# EAGLE design v.0.0.4 (EAGLE 5.11)

## Sheet 1 of 8
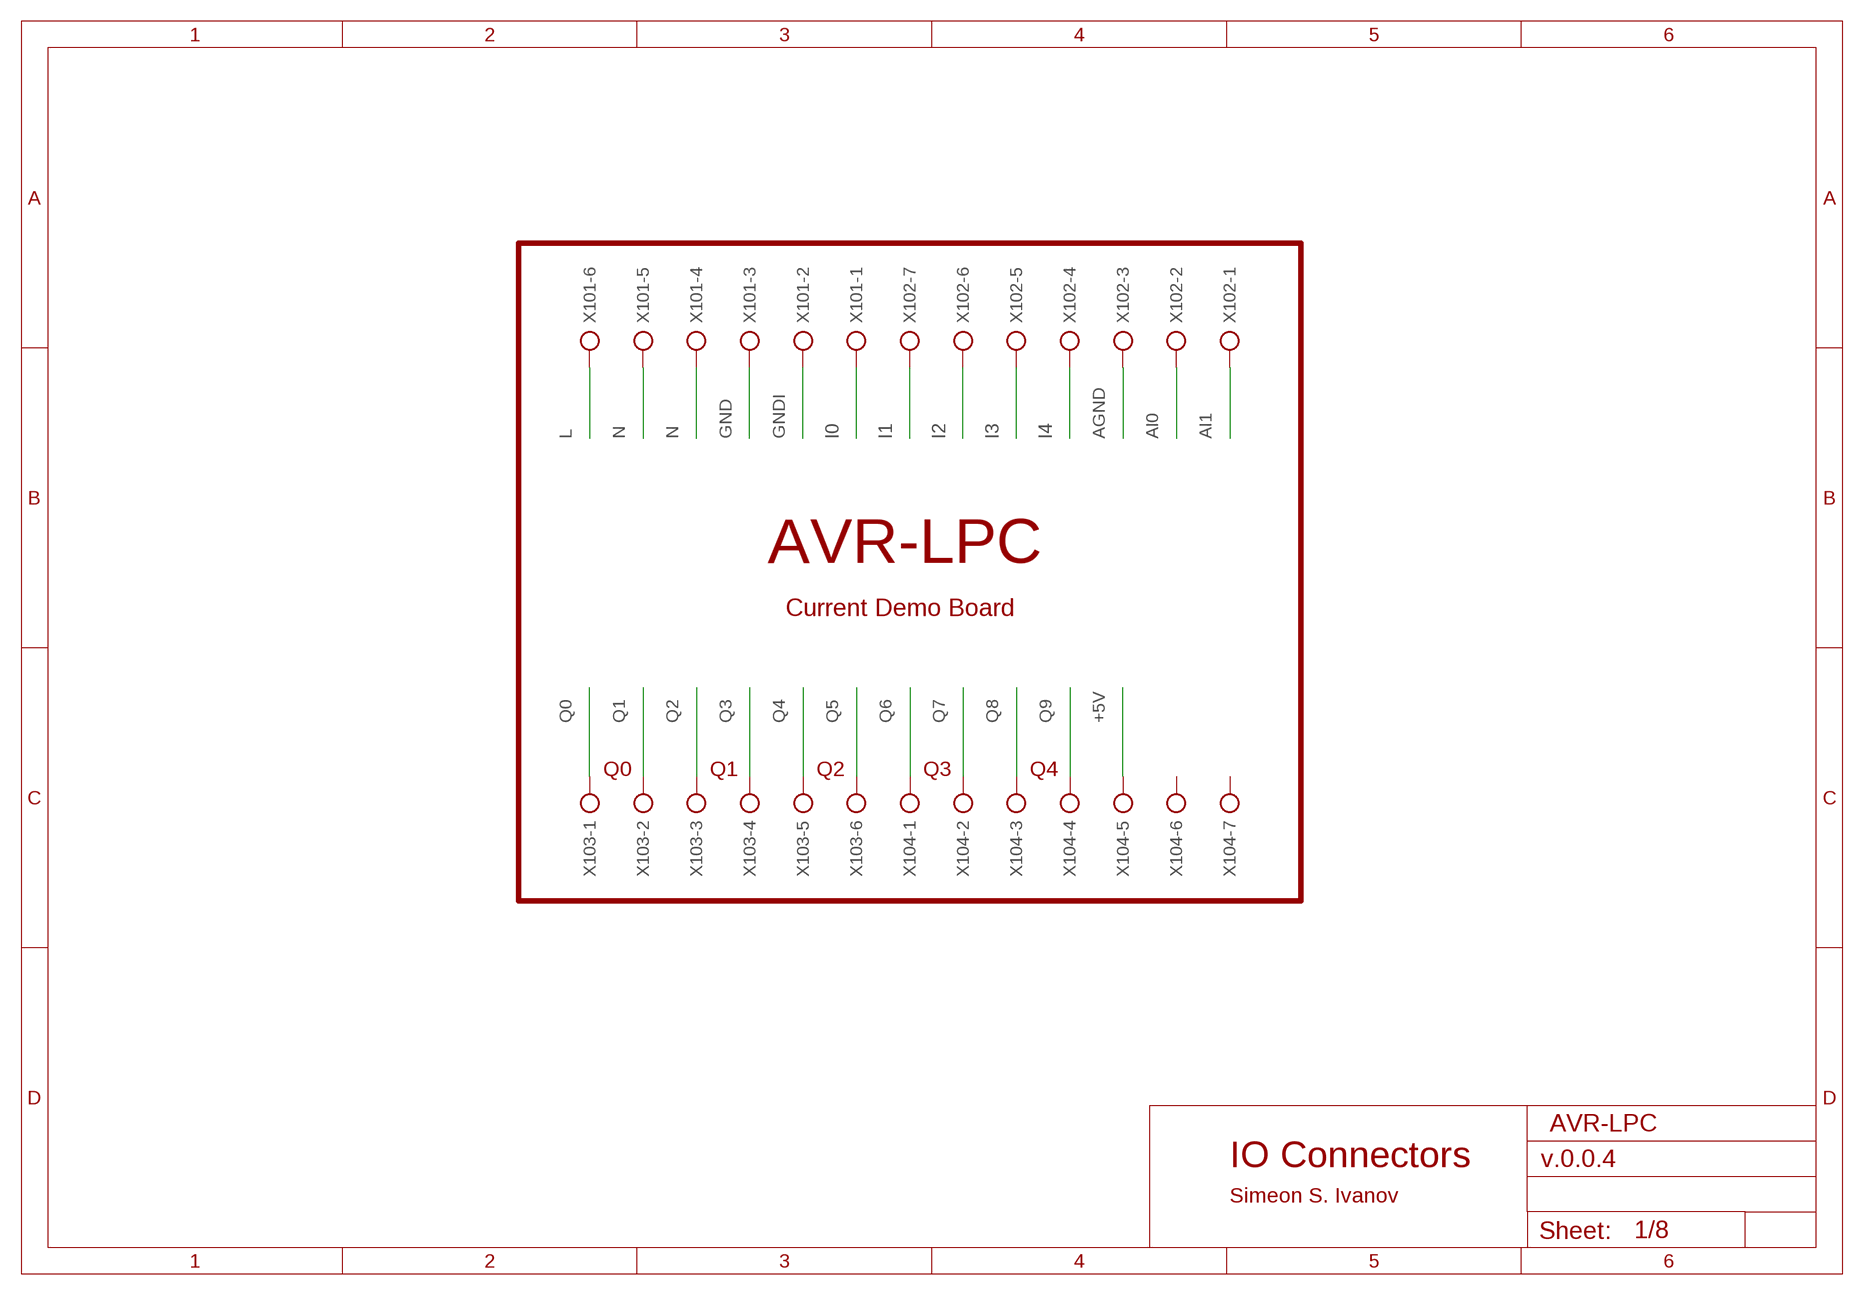
[diagram p0: schematic, sheet 1]

### Parts
X101  AK500/61  [AWG/6-H]
X102  AK500/71  [AWG/7-H]
X103  AK500/61  [AWG/6-H]
X104  AK500/71  [AWG/7-H]

### Nets
+5V: X104.5 ; also sheet 2,3,4,5,6
AGND: X102.3 ; also sheet 2,8
AI0: X102.2 ; also sheet 8
AI1: X102.1 ; also sheet 8
GND: X101.3 ; also sheet 2,3,4,5,6,7
GNDI: X101.2 ; also sheet 2,6
I0: X101.1 ; also sheet 6
I1: X102.7 ; also sheet 6
I2: X102.6 ; also sheet 6
I3: X102.5 ; also sheet 6
I4: X102.4 ; also sheet 6
L: X101.6 ; also sheet 2
N: X101.4 X101.5 ; also sheet 2
Q0: X103.1 ; also sheet 7
Q1: X103.2 ; also sheet 7
Q2: X103.3 ; also sheet 7
Q3: X103.4 ; also sheet 7
Q4: X103.5 ; also sheet 7
Q5: X103.6 ; also sheet 7
Q6: X104.1 ; also sheet 7
Q7: X104.2 ; also sheet 7
Q8: X104.3 ; also sheet 7
Q9: X104.4 ; also sheet 7
Unconnected: X104.6 X104.7

### Notes on the sheet
- AVR-LPC
- Current Demo Board
- Q0 | Q1 | Q2 | Q3 | Q4
- AVR-LPC
- IO Connectors
- Simeon S. Ivanov

## Sheet 2 of 8
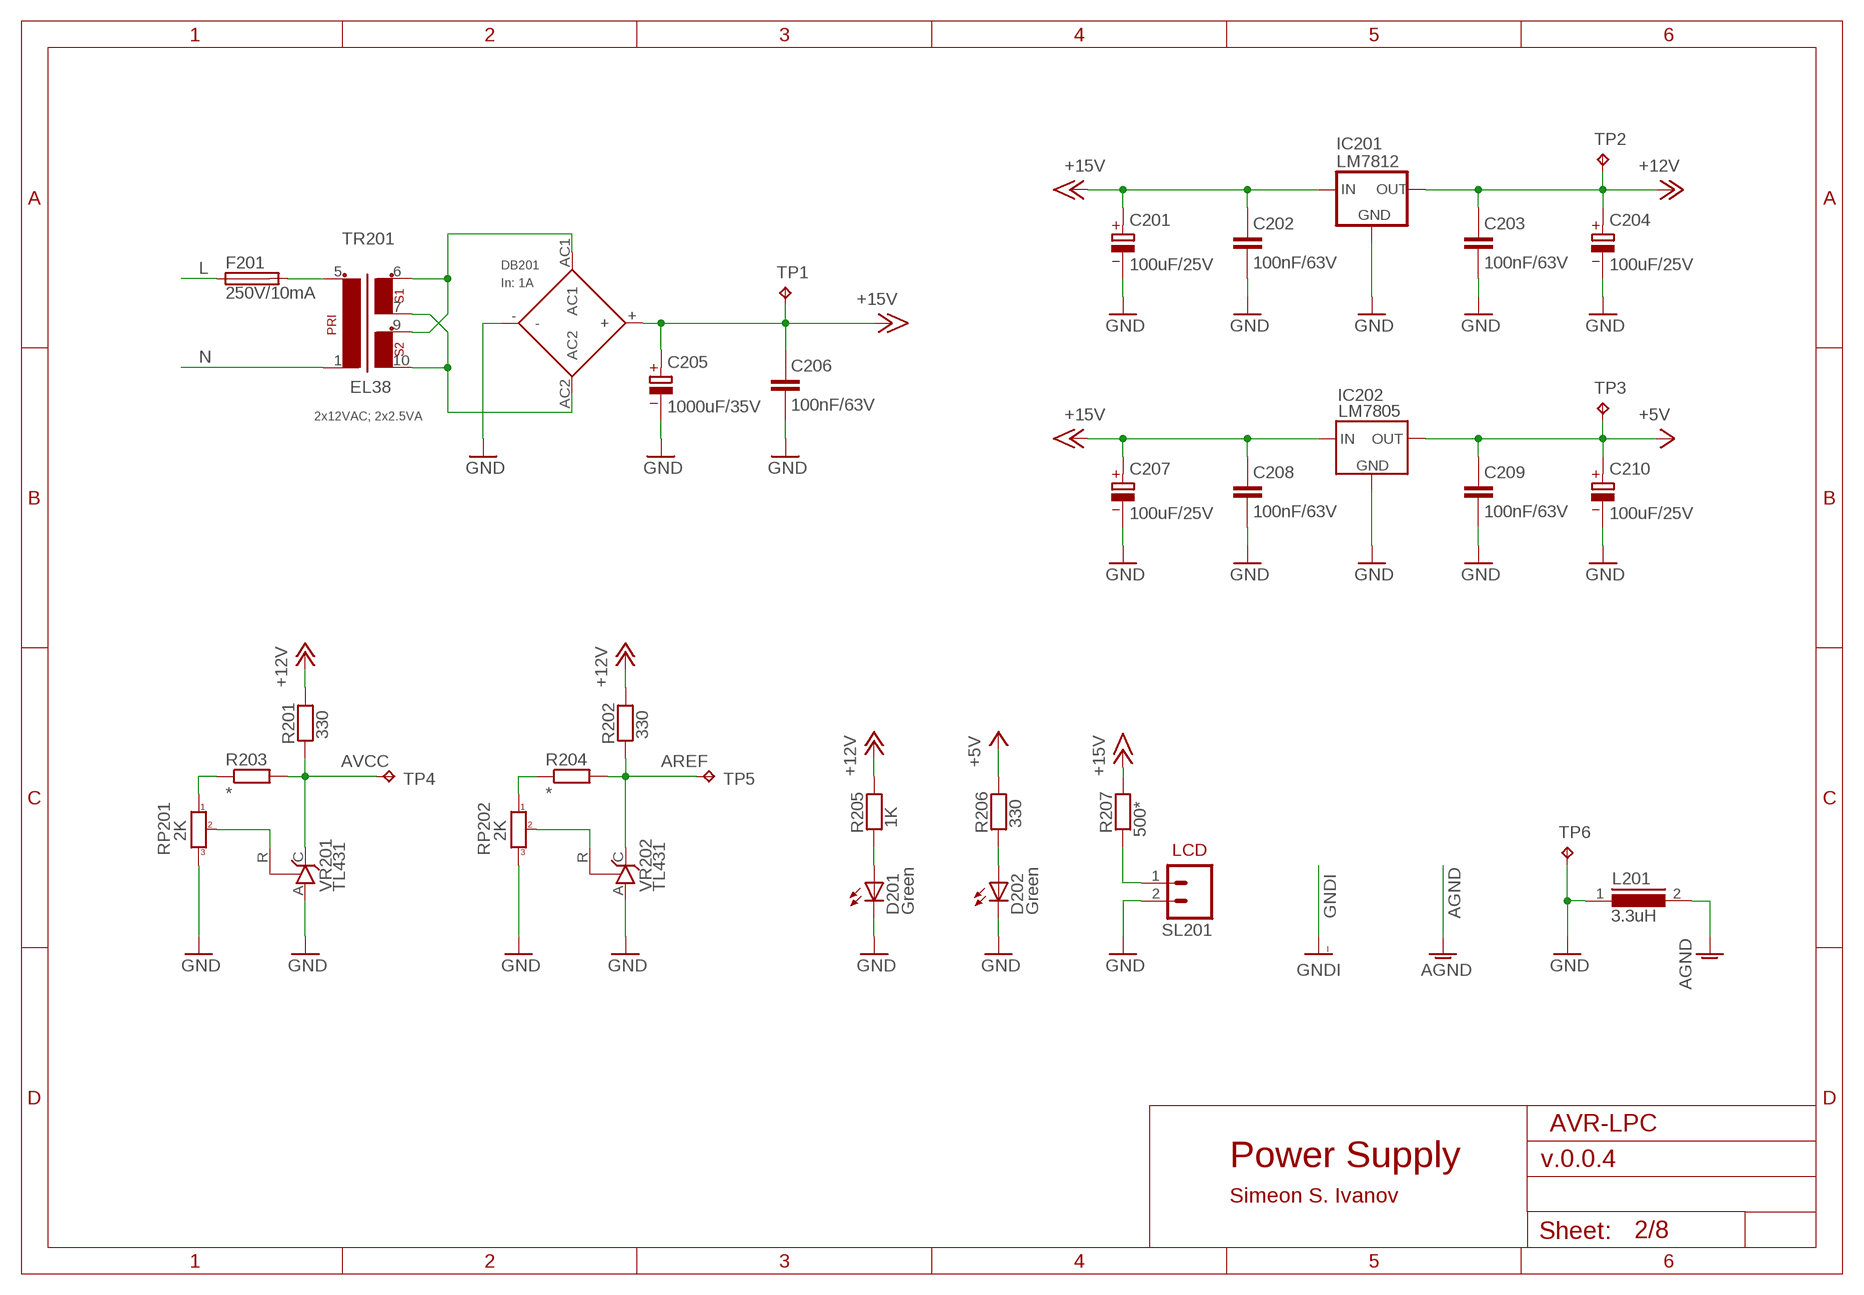
[diagram p1: schematic, sheet 2]

### Parts
C201  100uF/25V  CPOL-EU_Ø250  [CP100X80X24]
C202  100nF/63V  C-EU_2  [C100X86X24]
C203  100nF/63V  C-EU_2  [C100X86X24]
C204  100uF/25V  CPOL-EU_Ø250  [CP100X80X24]
C205  1000uF/35V  CPOL-EU_Ø500Ø400Ø300  [CP500/300X100X24]
C206  100nF/63V  C-EU_3  [C200X100X24]
C207  100uF/25V  CPOL-EU_Ø250  [CP100X80X24]
C208  100nF/63V  C-EU_3  [C200X100X24]
C209  100nF/63V  C-EU_3  [C200X100X24]
C210  100uF/25V  CPOL-EU_Ø250  [CP100X80X24]
D201  Green  LED5MM  [LED5MM]
D202  Green  LED5MM  [LED5MM]
DB201  In: 1A  DB104  [DB104]
F201  250V/10mA  GSH15  [GSH15]
IC201  LM7812  78LXX  [78LXX]
IC202  LM7805  78XXSC1  [78XX_VERTICAL_COOLER]
L201  3.3uH  MICC12  [MICC12]
R201  330  R-EU_2  [R100X86X24]
R202  330  R-EU_2  [R100X86X24]
R203  *  R-EU_M0805  [M0805]
R204  *  R-EU_M0805  [M0805]
R205  1K  R-EU_3  [R200X86X24]
R206  330  R-EU_3  [R200X86X24]
R207  500*  R-EU_11  [R425X86X24]
RP201  2K  RP-EU_  [RP0]
RP202  2K  RP-EU_  [RP0]
SL201  M02  [02P]
TP1  TPPAD1-17  [P1-17]
TP2  TPPAD1-17  [P1-17]
TP3  TPPAD1-17  [P1-17]
TP4  TPPAD1-17  [P1-17]
TP5  TPPAD1-17  [P1-17]
TP6  TPPAD1-17  [P1-17]
TR201  EL38  EI38-2  [EI38-2]
VR201  TL431  TL431CLP  [TO92-CLP]
VR202  TL431  TL431CLP  [TO92-CLP]

### Nets
+5V: C209.P$1 C210.+ IC202.OUT R206.P$2 TP3.TP ; also sheet 1,3,4,5,6
+12V: C203.P$1 C204.+ IC201.OUT R201.P$2 R202.P$2 R205.P$2 TP2.TP ; also sheet 8
+15V: C201.+ C202.P$1 C205.+ C206.P$1 C207.+ C208.P$1 DB201.+ IC201.IN IC202.IN R207.P$2 TP1.TP ; also sheet 7
AGND: L201.2 ; also sheet 1,8
AREF: R202.P$1 R204.2 TP5.TP VR202.C ; also sheet 3
AVCC: R201.P$1 R203.2 TP4.TP VR201.C ; also sheet 3
GND: C201.- C202.P$2 C203.P$2 C204.- C205.- C206.P$2 C207.- C208.P$2 C209.P$2 C210.- D201.K(C) D202.K(C) DB201.- IC201.GND IC202.GND L201.1 RP201.3 RP202.3 SL201.2 TP6.TP VR201.A VR202.A ; also sheet 1,3,4,5,6,7
L: F201.1 ; also sheet 1
N: TR201.1 ; also sheet 1
N$1: F201.2 TR201.5
N$3: RP201.2 VR201.R
N$5: RP202.2 VR202.R
N$6: DB201.AC1 TR201.6 TR201.9
N$15: R203.1 RP201.1
N$20: D201.A R205.P$1
N$29: R207.P$1 SL201.1
N$34: D202.A R206.P$1
N$37: DB201.AC2 TR201.7 TR201.10
N$47: R204.1 RP202.1

### Notes on the sheet
- 2x12VAC; 2x2.5VA
- LCD
- AVR-LPC
- Power Supply
- Simeon S. Ivanov

## Sheet 3 of 8
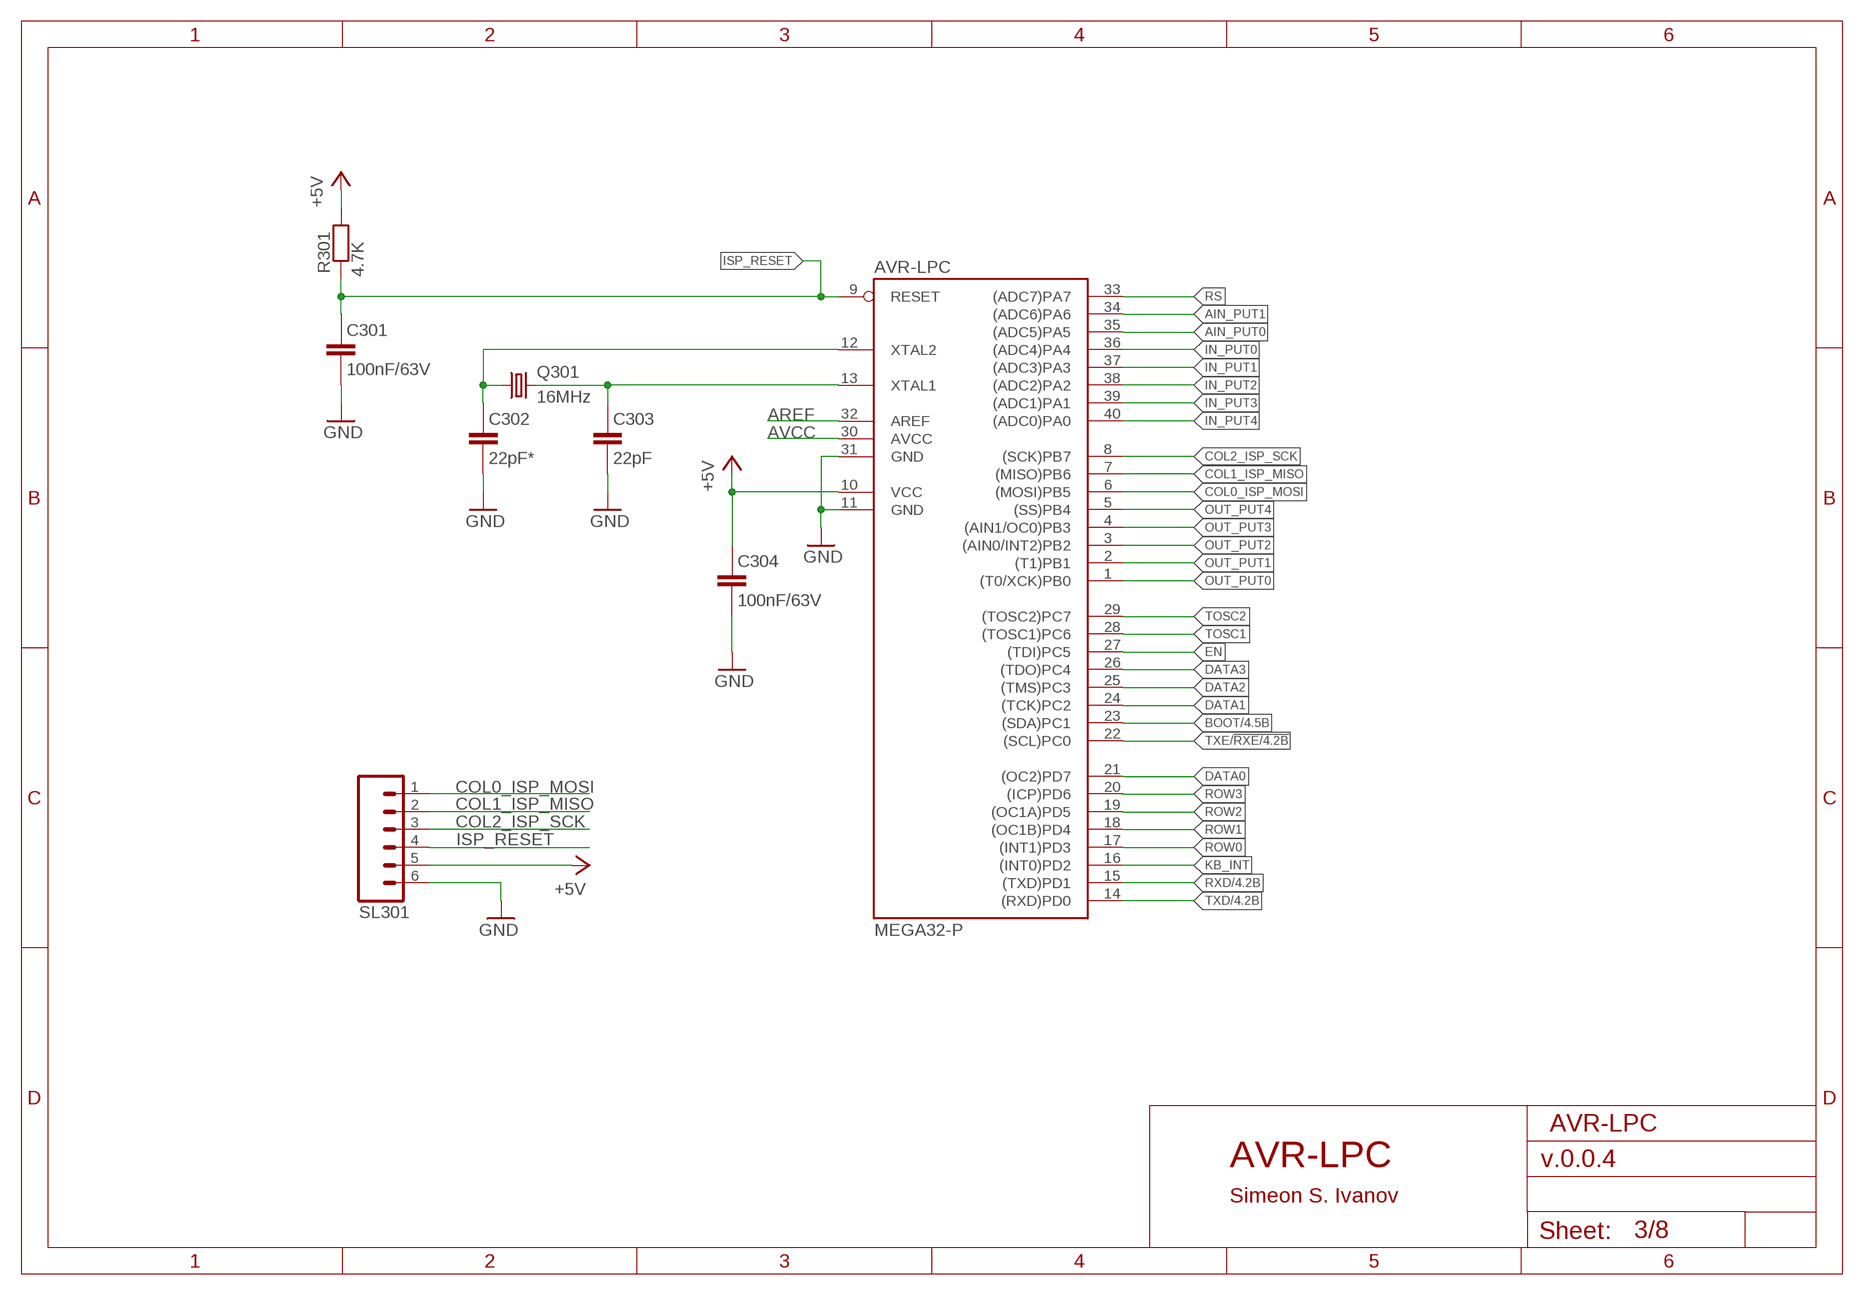
[diagram p2: schematic, sheet 3]

### Parts
AVR-LPC  MEGA32-P  [DIL40]
C301  100nF/63V  C-EU_3  [C200X100X24]
C302  22pF*  C-EU_2  [C100X86X24]
C303  22pF  C-EU_2  [C100X86X24]
C304  100nF/63V  C-EU_3  [C200X100X24]
Q301  16MHz  CRYSTALHC49U-V  [HC49U-V]
R301  4.7K  R-EU_2  [R100X86X24]
SL301  M06  [06P]

### Nets
+5V: AVR-LPC.10(VCC) C304.P$1 R301.P$2 SL301.5 ; also sheet 1,2,4,5,6
AIN_PUT0: AVR-LPC.35((ADC5)PA5) ; also sheet 8
AIN_PUT1: AVR-LPC.34((ADC6)PA6) ; also sheet 8
AREF: AVR-LPC.32(AREF) ; also sheet 2
AVCC: AVR-LPC.30(AVCC) ; also sheet 2
BOOT: AVR-LPC.23((SDA)PC1) ; also sheet 4
COL0_ISP_MOSI: AVR-LPC.6((MOSI)PB5) SL301.1 ; also sheet 5
COL1_ISP_MISO: AVR-LPC.7((MISO)PB6) SL301.2 ; also sheet 5
COL2_ISP_SCK: AVR-LPC.8((SCK)PB7) SL301.3 ; also sheet 5
DATA0: AVR-LPC.21((OC2)PD7) ; also sheet 5
DATA1: AVR-LPC.24((TCK)PC2) ; also sheet 5
DATA2: AVR-LPC.25((TMS)PC3) ; also sheet 5
DATA3: AVR-LPC.26((TDO)PC4) ; also sheet 5
EN: AVR-LPC.27((TDI)PC5) ; also sheet 5
GND: AVR-LPC.11(GND) AVR-LPC.31(GND) C301.P$2 C302.P$2 C303.P$2 C304.P$2 SL301.6 ; also sheet 1,2,4,5,6,7
IN_PUT0: AVR-LPC.36((ADC4)PA4) ; also sheet 6
IN_PUT1: AVR-LPC.37((ADC3)PA3) ; also sheet 6
IN_PUT2: AVR-LPC.38((ADC2)PA2) ; also sheet 6
IN_PUT3: AVR-LPC.39((ADC1)PA1) ; also sheet 6
IN_PUT4: AVR-LPC.40((ADC0)PA0) ; also sheet 6
ISP_RESET: AVR-LPC.9(RESET) C301.P$1 R301.P$1 SL301.4
KB_INT: AVR-LPC.16((INT0)PD2) ; also sheet 5
N$10: AVR-LPC.12(XTAL2) C302.P$1 Q301.1
N$11: AVR-LPC.13(XTAL1) C303.P$1 Q301.2
OUT_PUT0: AVR-LPC.1((T0/XCK)PB0) ; also sheet 7
OUT_PUT1: AVR-LPC.2((T1)PB1) ; also sheet 7
OUT_PUT2: AVR-LPC.3((AIN0/INT2)PB2) ; also sheet 7
OUT_PUT3: AVR-LPC.4((AIN1/OC0)PB3) ; also sheet 7
OUT_PUT4: AVR-LPC.5((SS)PB4) ; also sheet 7
ROW0: AVR-LPC.17((INT1)PD3) ; also sheet 5
ROW1: AVR-LPC.18((OC1B)PD4) ; also sheet 5
ROW2: AVR-LPC.19((OC1A)PD5) ; also sheet 5
ROW3: AVR-LPC.20((ICP)PD6) ; also sheet 5
RS: AVR-LPC.33((ADC7)PA7) ; also sheet 5
RXD: AVR-LPC.15((TXD)PD1) ; also sheet 4
TOSC1: AVR-LPC.28((TOSC1)PC6)
TOSC2: AVR-LPC.29((TOSC2)PC7)
TXD: AVR-LPC.14((RXD)PD0) ; also sheet 4
TXE/!RXE: AVR-LPC.22((SCL)PC0) ; also sheet 4

### Notes on the sheet
- AVR-LPC
- AVR-LPC
- Simeon S. Ivanov

## Sheet 4 of 8
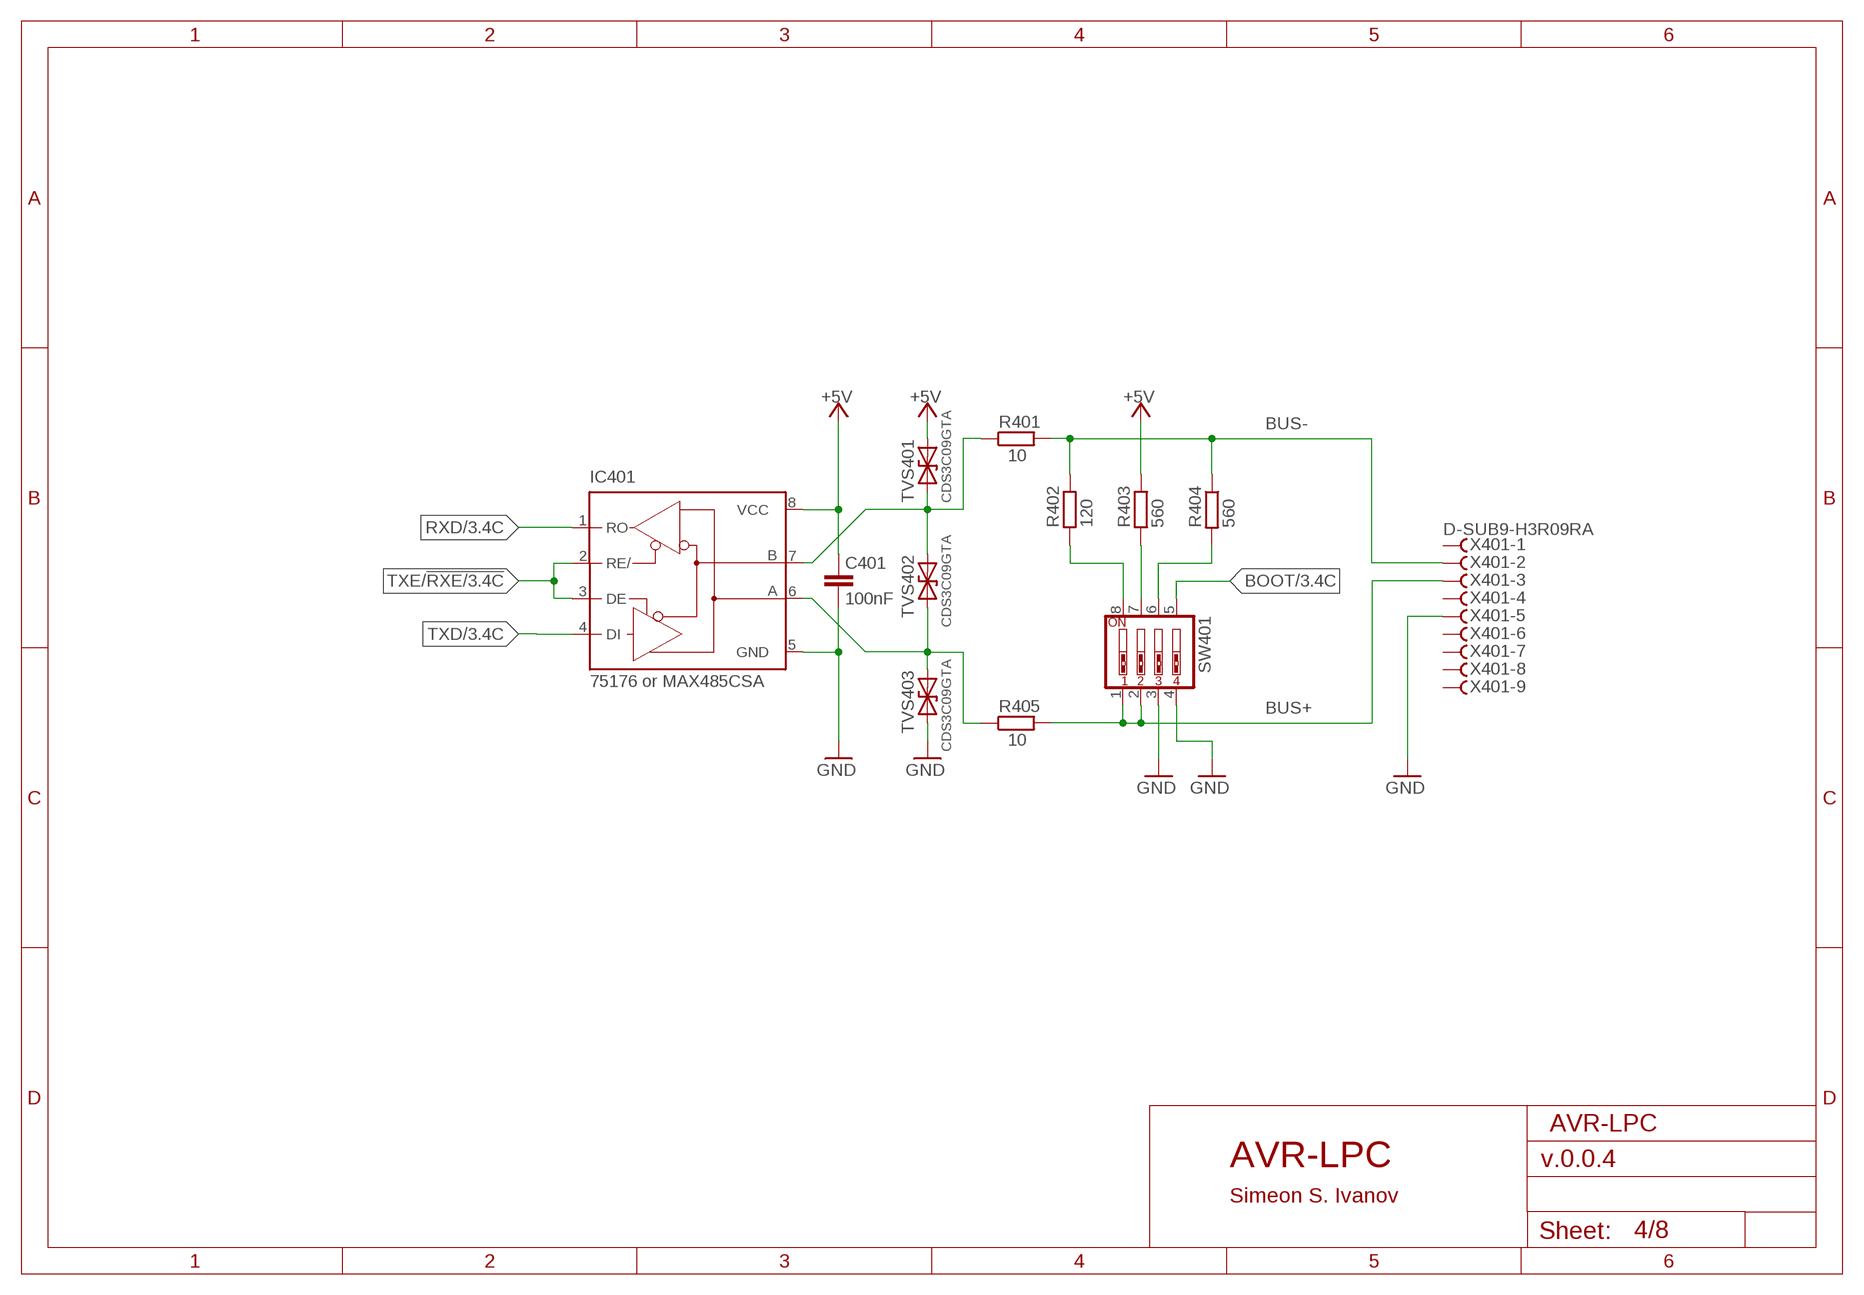
[diagram p3: schematic, sheet 4]

### Parts
C401  100nF  C-EU050-025X075  [C050-025X075]
IC401  75176 or MAX485CSA  MAX3468CSA  [SO08]
R401  10  R-EU_R1206  [R1206]
R402  120  R-EU_R1206  [R1206]
R403  560  R-EU_R0805  [R0805]
R404  560  R-EU_R0805  [R0805]
R405  10  R-EU_R1206  [R1206]
SW401  SW_DIP-4  [EDG-04]
TVS401  CDS3C09GTA  B72500DD06063  [D0603]
TVS402  CDS3C09GTA  B72500DD06063  [D0603]
TVS403  CDS3C09GTA  B72500DD06063  [D0603]
X401  D-SUB9-H3R09RA  [H3R09RA]

### Nets
+5V: C401.2 IC401.8(VCC) R403.2 TVS401.2 ; also sheet 1,2,3,5,6
BOOT: SW401.5 ; also sheet 3
BUS+: R405.2 SW401.1 SW401.2 X401.3
BUS-: R401.2 R402.2 R404.1 X401.2
GND: C401.1 IC401.5(GND) SW401.3 SW401.4 TVS403.1 X401.5 ; also sheet 1,2,3,5,6,7
N$46: IC401.7(B) R401.1 TVS401.1 TVS402.2
N$93: IC401.6(A) R405.1 TVS402.1 TVS403.2
N$112: R403.1 SW401.7
N$129: R404.2 SW401.6
N$140: R402.1 SW401.8
RXD: IC401.1(RO) ; also sheet 3
TXD: IC401.4(DI) ; also sheet 3
TXE/!RXE: IC401.2(RE/) IC401.3(DE) ; also sheet 3
Unconnected: X401.1 X401.4 X401.6 X401.7 X401.8 X401.9

### Notes on the sheet
- AVR-LPC
- AVR-LPC
- Simeon S. Ivanov

## Sheet 5 of 8
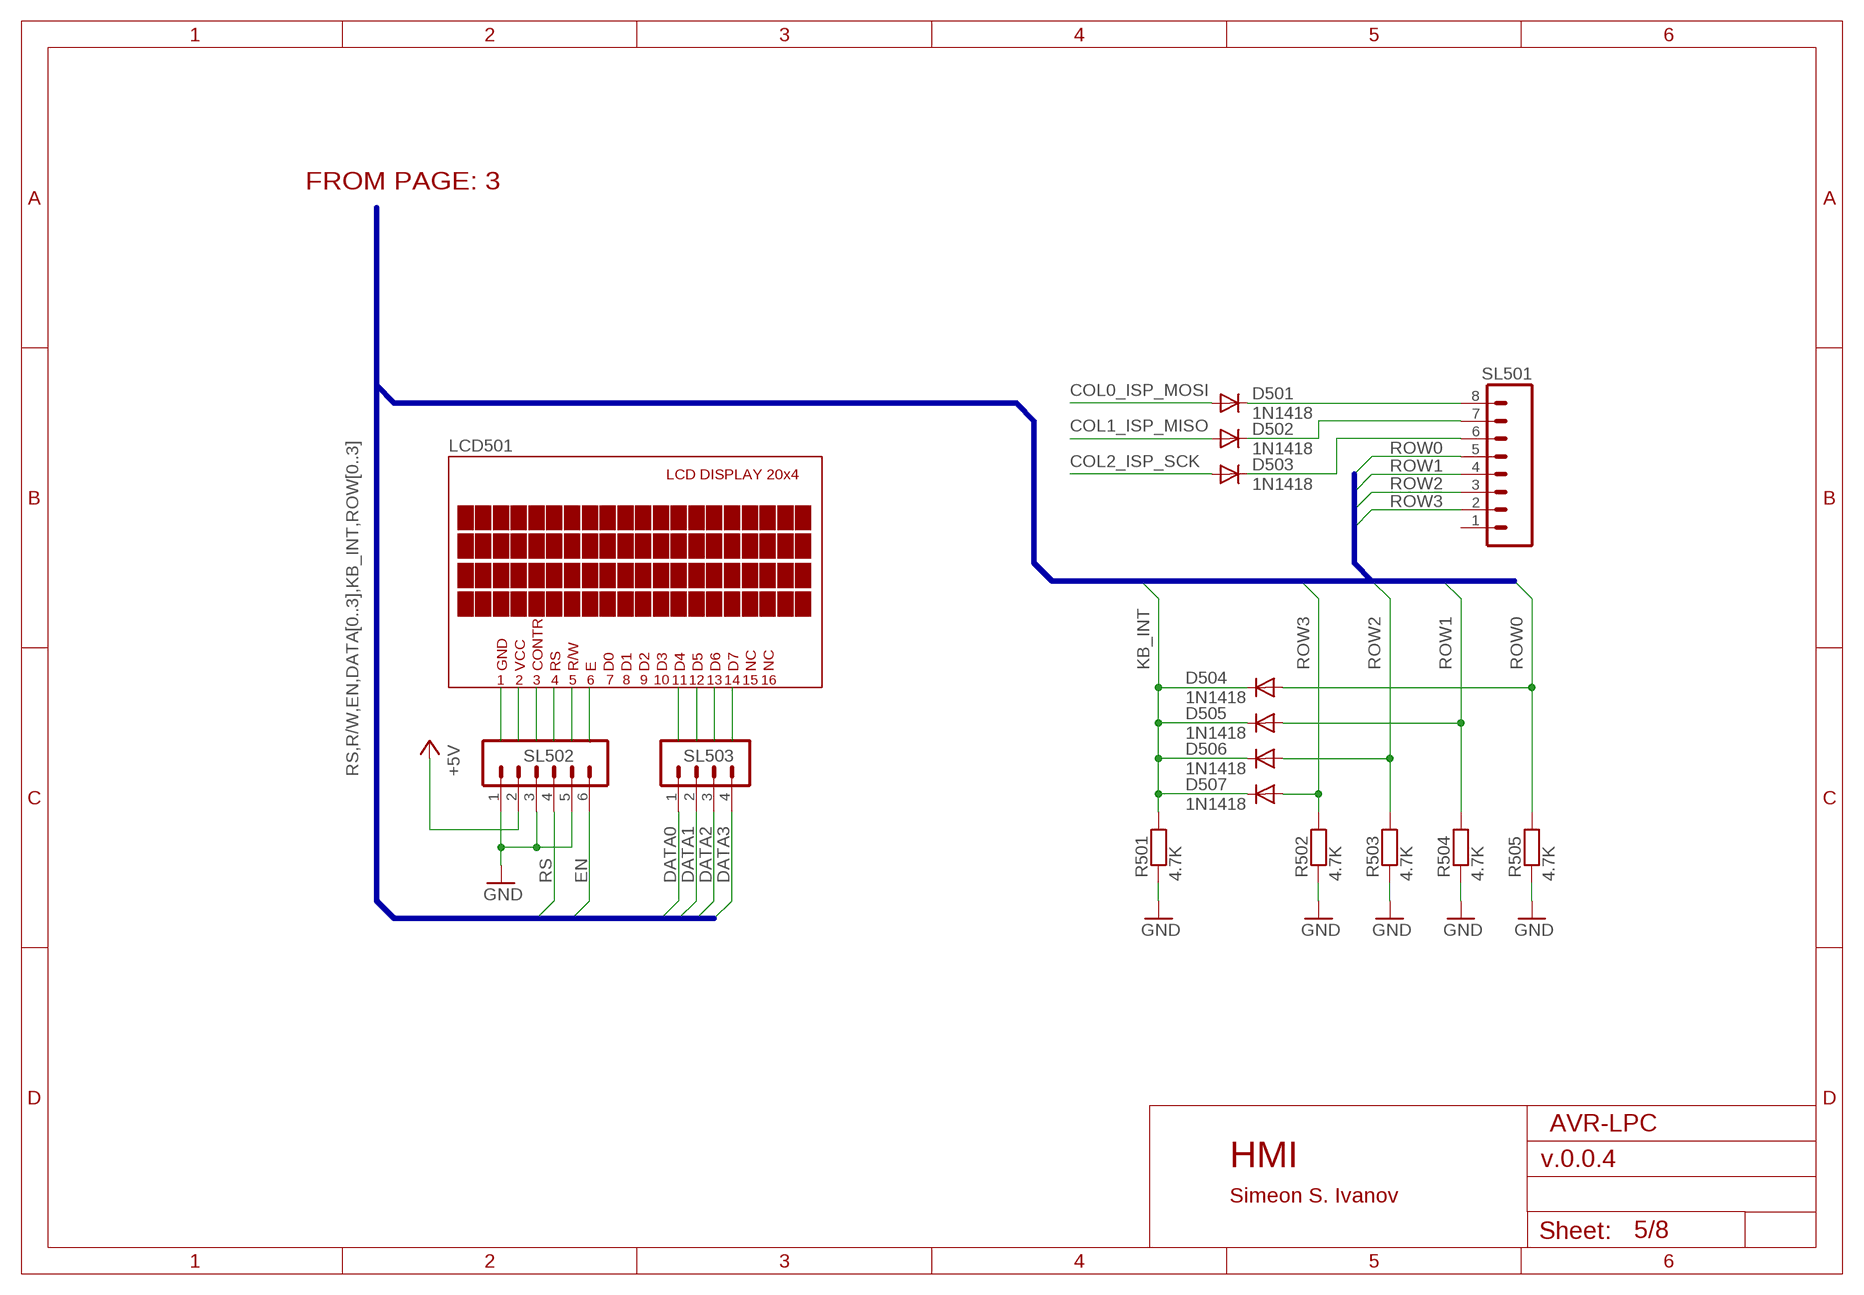
[diagram p4: schematic, sheet 5]

### Parts
D501  1N1418  DIODE-D-5  [D-5]
D502  1N1418  DIODE-D-5  [D-5]
D503  1N1418  DIODE-D-5  [D-5]
D504  1N1418  DIODE-D-2.5  [D-2.5]
D505  1N1418  DIODE-D-2.5  [D-2.5]
D506  1N1418  DIODE-D-2.5  [D-2.5]
D507  1N1418  DIODE-D-2.5  [D-2.5]
LCD501  JM204_SIZESIZE  [JM20X4]
R501  4.7K  R-EU_9  [R300X86X24]
R502  4.7K  R-EU_10  [R350X86X24]
R503  4.7K  R-EU_10  [R350X86X24]
R504  4.7K  R-EU_10  [R350X86X24]
R505  4.7K  R-EU_10  [R350X86X24]
SL501  M08  [08P]
SL502  M06  [06P]
SL503  M04  [04P]

### Nets
+5V: SL502.2 ; also sheet 1,2,3,4,6
COL0_ISP_MOSI: D501.A ; also sheet 3
COL1_ISP_MISO: D502.A ; also sheet 3
COL2_ISP_SCK: D503.A ; also sheet 3
DATA0: SL503.1 ; also sheet 3
DATA1: SL503.2 ; also sheet 3
DATA2: SL503.3 ; also sheet 3
DATA3: SL503.4 ; also sheet 3
EN: SL502.6 ; also sheet 3
GND: R501.P$1 R502.P$1 R503.P$1 R504.P$1 R505.P$1 SL502.1 SL502.3 SL502.5 ; also sheet 1,2,3,4,6,7
KB_INT: D504.C D505.C D506.C D507.C R501.P$2 ; also sheet 3
N$24: D501.C SL501.8
N$25: D502.C SL501.7
N$28: D503.C SL501.6
ROW0: D504.A R505.P$2 SL501.5 ; also sheet 3
ROW1: D505.A R504.P$2 SL501.4 ; also sheet 3
ROW2: D506.A R503.P$2 SL501.3 ; also sheet 3
ROW3: D507.A R502.P$2 SL501.2 ; also sheet 3
RS: SL502.4 ; also sheet 3
Unconnected: SL501.1

### Buses
RS,R/W,EN,DATA[0..3],KB_INT,ROW[0..3]
KB_INT,ROW[0..3]

### Notes on the sheet
- FROM PAGE: 3
- AVR-LPC
- HMI
- Simeon S. Ivanov

## Sheet 6 of 8
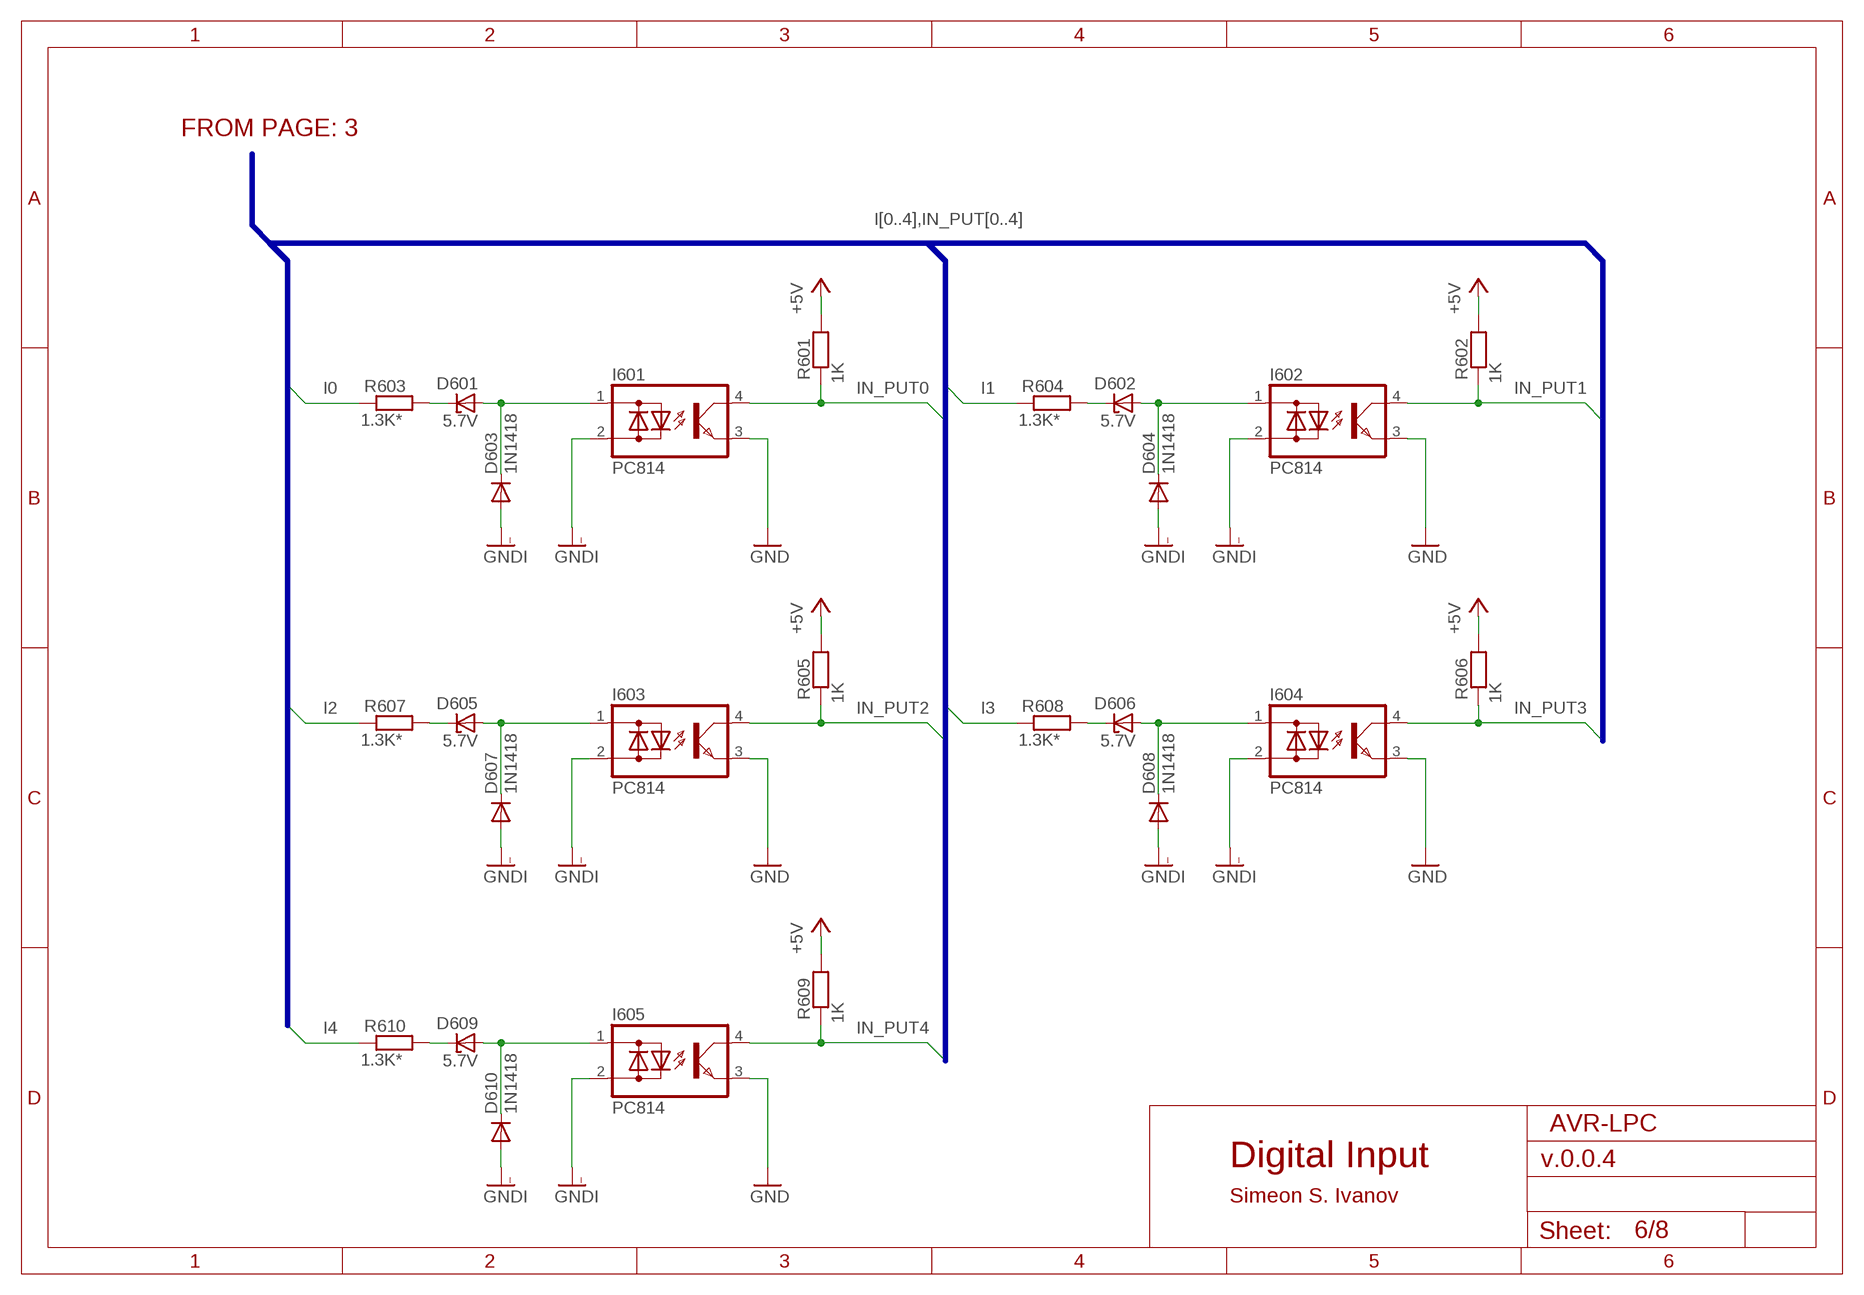
[diagram p5: schematic, sheet 6]

### Parts
D601  5.7V  ZENER-DIODEZD-2.5  [ZDIO-2.5]
D602  5.7V  ZENER-DIODEZD-2.5  [ZDIO-2.5]
D603  1N1418  DIODE-D-2.5  [D-2.5]
D604  1N1418  DIODE-D-2.5  [D-2.5]
D605  5.7V  ZENER-DIODEZD-2.5  [ZDIO-2.5]
D606  5.7V  ZENER-DIODEZD-2.5  [ZDIO-2.5]
D607  1N1418  DIODE-D-2.5  [D-2.5]
D608  1N1418  DIODE-D-2.5  [D-2.5]
D609  5.7V  ZENER-DIODEZD-2.5  [ZDIO-2.5]
D610  1N1418  DIODE-D-2.5  [D-2.5]
I601  PC814  [DIL04]
I602  PC814  [DIL04]
I603  PC814  [DIL04]
I604  PC814  [DIL04]
I605  PC814  [DIL04]
R601  1K  R-EU_11  [R425X86X24]
R602  1K  R-EU_11  [R425X86X24]
R603  1.3K*  R-EU_2  [R100X86X24]
R604  1.3K*  R-EU_2  [R100X86X24]
R605  1K  R-EU_11  [R425X86X24]
R606  1K  R-EU_11  [R425X86X24]
R607  1.3K*  R-EU_2  [R100X86X24]
R608  1.3K*  R-EU_2  [R100X86X24]
R609  1K  R-EU_11  [R425X86X24]
R610  1.3K*  R-EU_2  [R100X86X24]

### Nets
+5V: R601.P$2 R602.P$2 R605.P$2 R606.P$2 R609.P$2 ; also sheet 1,2,3,4,5
GND: I601.3(E) I602.3(E) I603.3(E) I604.3(E) I605.3(E) ; also sheet 1,2,3,4,5,7
GNDI: D603.A D604.A D607.A D608.A D610.A I601.2(AC2) I602.2(AC2) I603.2(AC2) I604.2(AC2) I605.2(AC2) ; also sheet 1,2
I0: R603.P$1 ; also sheet 1
I1: R604.P$1 ; also sheet 1
I2: R607.P$1 ; also sheet 1
I3: R608.P$1 ; also sheet 1
I4: R610.P$1 ; also sheet 1
IN_PUT0: I601.4(C) R601.P$1 ; also sheet 3
IN_PUT1: I602.4(C) R602.P$1 ; also sheet 3
IN_PUT2: I603.4(C) R605.P$1 ; also sheet 3
IN_PUT3: I604.4(C) R606.P$1 ; also sheet 3
IN_PUT4: I605.4(C) R609.P$1 ; also sheet 3
N$22: D601.C R603.P$2
N$23: D601.A D603.C I601.1(AC1)
N$26: D605.C R607.P$2
N$27: D605.A D607.C I603.1(AC1)
N$39: D609.C R610.P$2
N$40: D609.A D610.C I605.1(AC1)
N$43: D602.C R604.P$2
N$44: D602.A D604.C I602.1(AC1)
N$51: D606.C R608.P$2
N$52: D606.A D608.C I604.1(AC1)

### Buses
I[0..4],IN_PUT[0..4]

### Notes on the sheet
- FROM PAGE: 3
- AVR-LPC
- Digital Input
- Simeon S. Ivanov

## Sheet 7 of 8
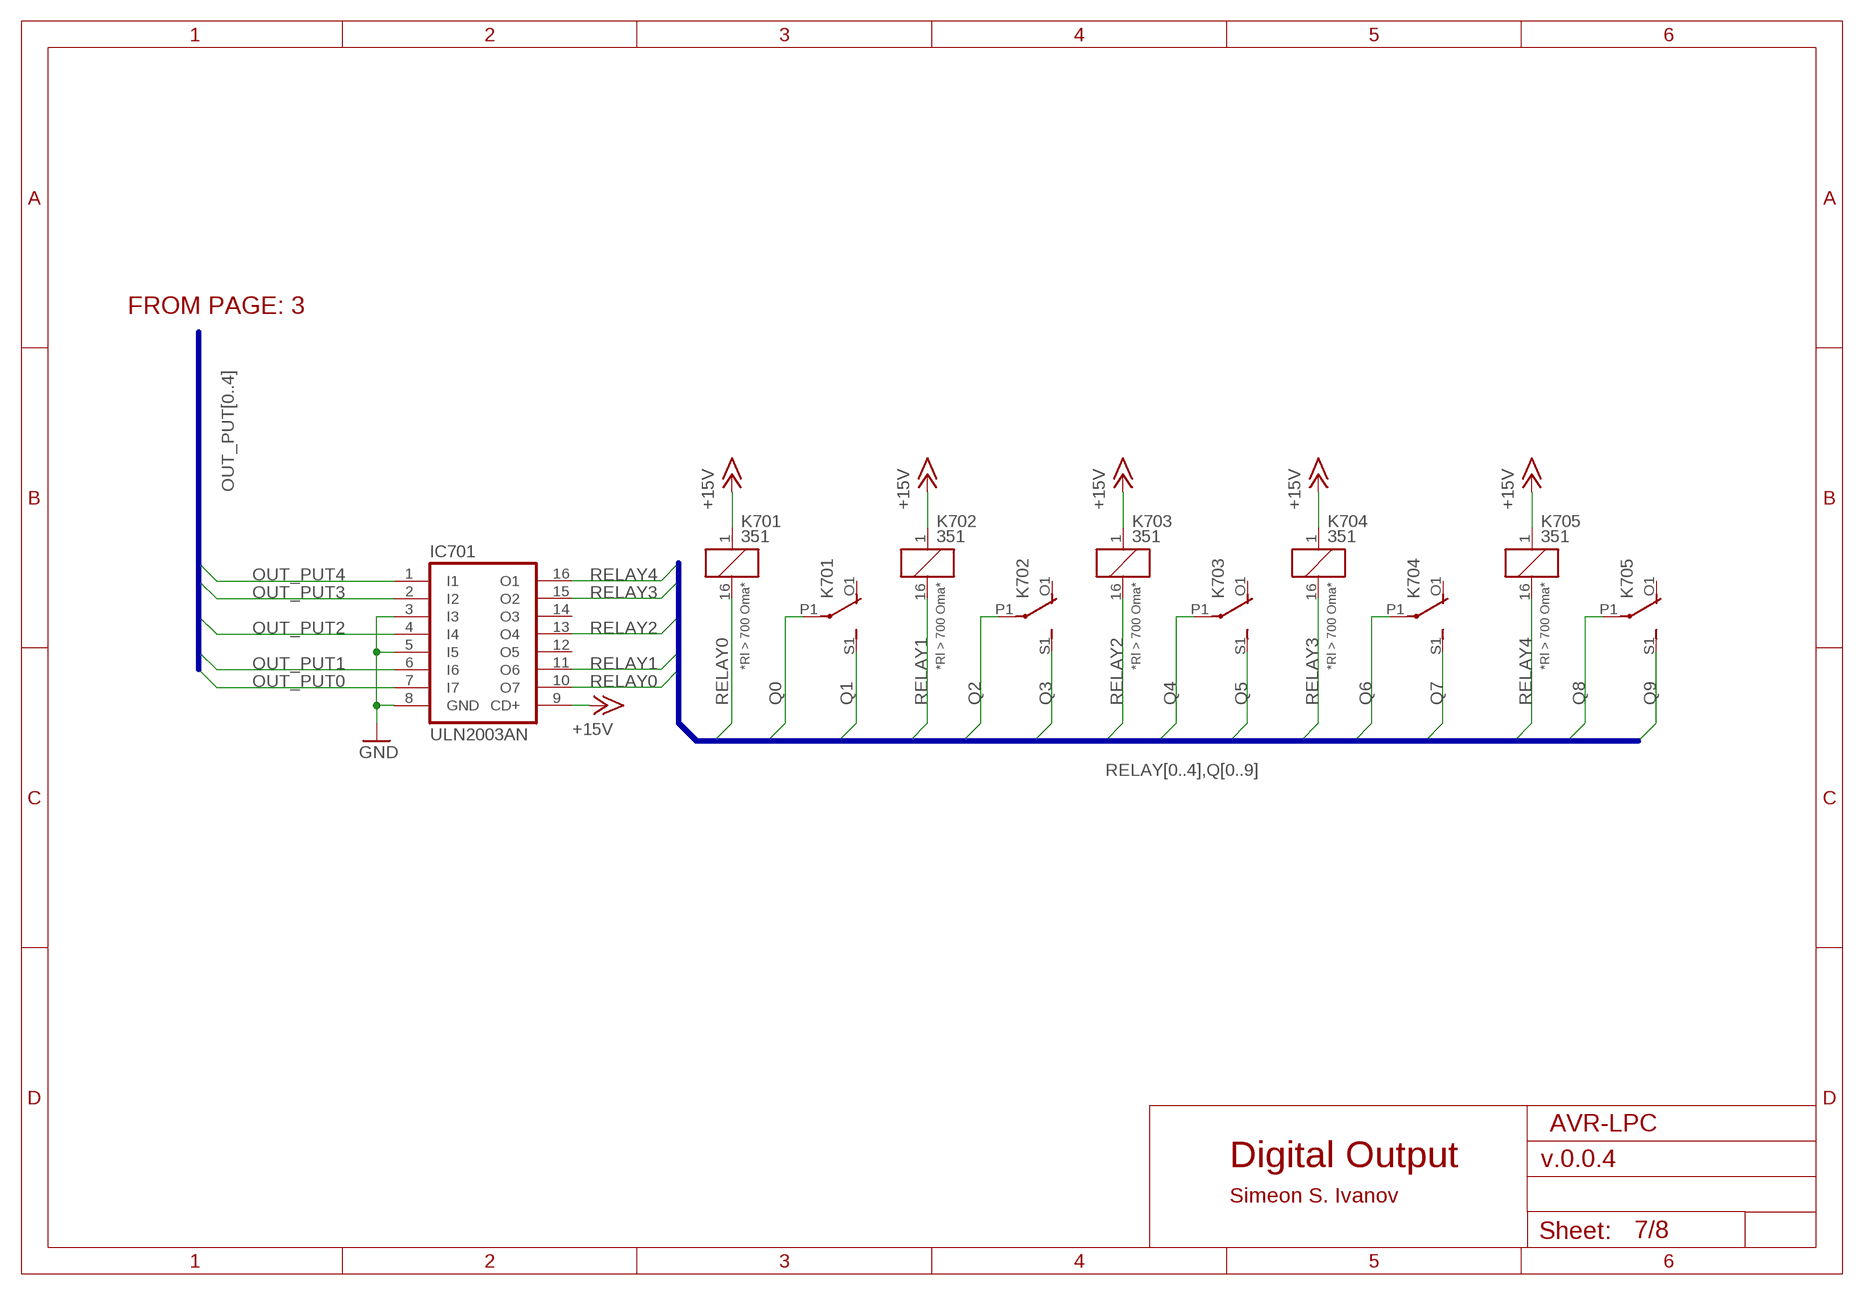
[diagram p6: schematic, sheet 7]

### Parts
IC701  ULN2003AN  [DIL16]
K701  351  [351]
K702  351  [351]
K703  351  [351]
K704  351  [351]
K705  351  [351]

### Nets
+15V: IC701.9(CD+) K701.1 K702.1 K703.1 K704.1 K705.1 ; also sheet 2
GND: IC701.3(I3) IC701.5(I5) IC701.8(GND) ; also sheet 1,2,3,4,5,6
OUT_PUT0: IC701.7(I7) ; also sheet 3
OUT_PUT1: IC701.6(I6) ; also sheet 3
OUT_PUT2: IC701.4(I4) ; also sheet 3
OUT_PUT3: IC701.2(I2) ; also sheet 3
OUT_PUT4: IC701.1(I1) ; also sheet 3
Q0: K701.P1(2:P) ; also sheet 1
Q1: K701.S1(2:S) ; also sheet 1
Q2: K702.P1(2:P) ; also sheet 1
Q3: K702.S1(2:S) ; also sheet 1
Q4: K703.P1(2:P) ; also sheet 1
Q5: K703.S1(2:S) ; also sheet 1
Q6: K704.P1(2:P) ; also sheet 1
Q7: K704.S1(2:S) ; also sheet 1
Q8: K705.P1(2:P) ; also sheet 1
Q9: K705.S1(2:S) ; also sheet 1
RELAY0: IC701.10(O7) K701.16
RELAY1: IC701.11(O6) K702.16
RELAY2: IC701.13(O4) K703.16
RELAY3: IC701.15(O2) K704.16
RELAY4: IC701.16(O1) K705.16
Unconnected: IC701.12(O5) IC701.14(O3) K701.O1(2:O) K701.O2(3:O) K701.P2(3:P) K701.S2(3:S) K702.O1(2:O) K702.O2(3:O) K702.P2(3:P) K702.S2(3:S) K703.O1(2:O) K703.O2(3:O) K703.P2(3:P) K703.S2(3:S) K704.O1(2:O) K704.O2(3:O) K704.P2(3:P) K704.S2(3:S) K705.O1(2:O) K705.O2(3:O) K705.P2(3:P) K705.S2(3:S)

### Buses
OUT_PUT[0..4]
RELAY[0..4],Q[0..9]

### Notes on the sheet
- FROM PAGE: 3
- *Rl > 700 Oma* | *Rl > 700 Oma* | *Rl > 700 Oma* | *Rl > 700 Oma* | *Rl > 700 Oma*
- AVR-LPC
- Digital Output
- Simeon S. Ivanov

## Sheet 8 of 8
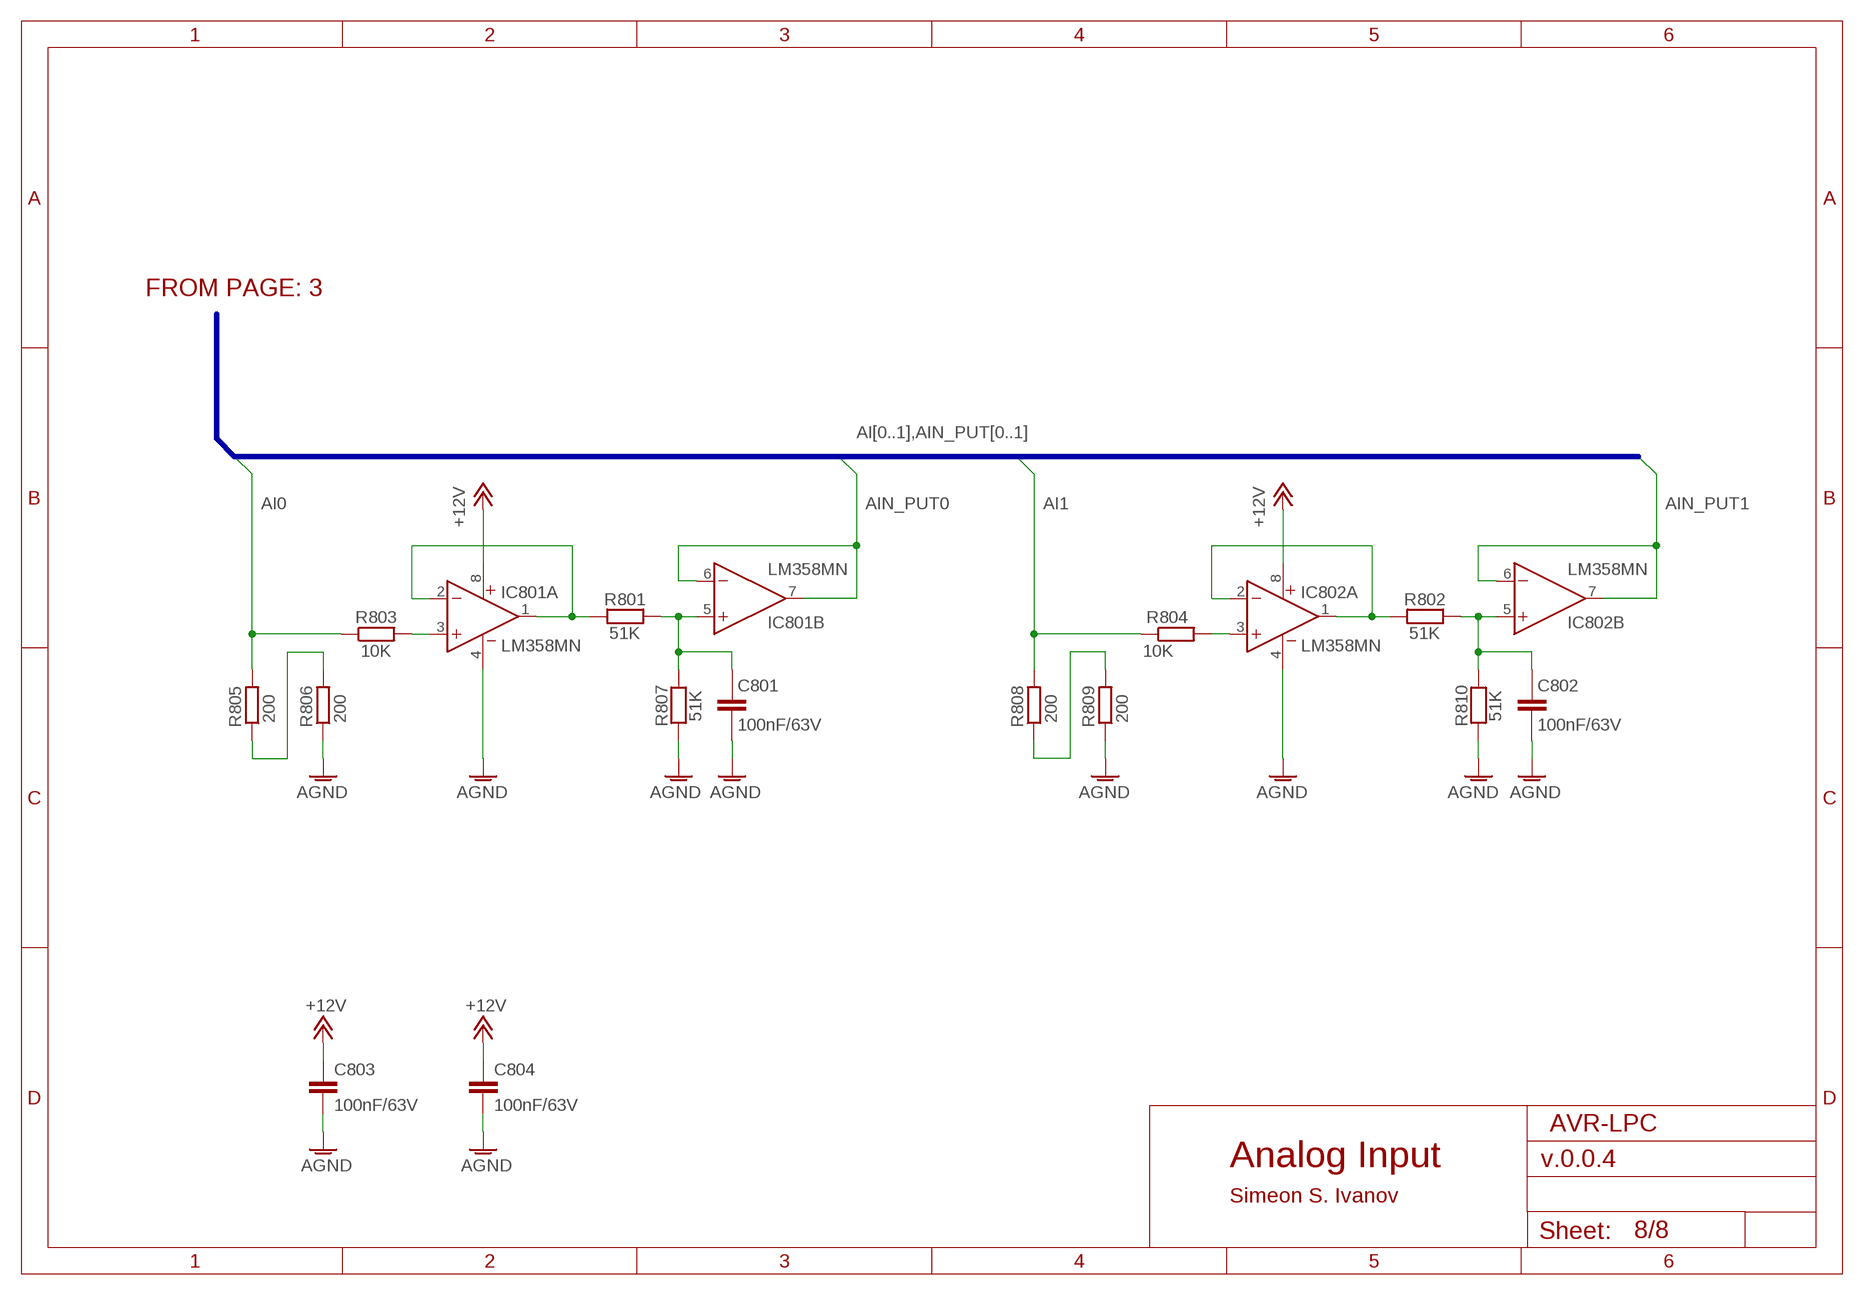
[diagram p7: schematic, sheet 8]

### Parts
C801  100nF/63V  C-EU_3  [C200X100X24]
C802  100nF/63V  C-EU_3  [C200X100X24]
C803  100nF/63V  C-EUC0805  [C0805]
C804  100nF/63V  C-EUC0805  [C0805]
IC801  LM358MN  [DIL8]
IC802  LM358MN  [DIL8]
R801  51K  R-EU_5  [R300X100X24]
R802  51K  R-EU_5  [R300X100X24]
R803  10K  R-EU_M0805  [M0805]
R804  10K  R-EU_M0805  [M0805]
R805  200  R-EU_M0805  [M0805]
R806  200  R-EU_M0805  [M0805]
R807  51K  R-EU_5  [R300X100X24]
R808  200  R-EU_M0805  [M0805]
R809  200  R-EU_M0805  [M0805]
R810  51K  R-EU_5  [R300X100X24]

### Nets
+12V: C803.1 C804.1 IC801.8(A:V+) IC802.8(A:V+) ; also sheet 2
AGND: C801.P$2 C802.P$2 C803.2 C804.2 IC801.4(A:V-) IC802.4(A:V-) R806.1 R807.P$1 R809.1 R810.P$1 ; also sheet 1,2
AI0: R803.1 R805.2 ; also sheet 1
AI1: R804.1 R808.2 ; also sheet 1
AIN_PUT0: IC801.6(B:-IN) IC801.7(B:OUT) ; also sheet 3
AIN_PUT1: IC802.6(B:-IN) IC802.7(B:OUT) ; also sheet 3
N$7: R805.1 R806.2
N$16: IC802.1(A:OUT) IC802.2(A:IN-) R802.P$2
N$21: IC801.3(A:IN+) R803.2
N$38: R808.1 R809.2
N$41: C801.P$1 IC801.5(B:IN+) R801.P$1 R807.P$2
N$42: IC801.1(A:OUT) IC801.2(A:IN-) R801.P$2
N$45: C802.P$1 IC802.5(B:IN+) R802.P$1 R810.P$2
N$48: IC802.3(A:IN+) R804.2

### Buses
AI[0..1],AIN_PUT[0..1]

### Notes on the sheet
- FROM PAGE: 3
- AVR-LPC
- Analog Input
- Simeon S. Ivanov

## Library data of the parts
AVR-LPC = atmel:MEGA32-P: MICROCONTROLLER 32 Kbytes FLASH 2 Kbytes SRAM 1 Kbytes EEPROM USART 8-channel 10 bit ADC Source: www.atmel.com .. doc2503.pdf
C201 C204 C205 C207 C210 = myRcl:CPOL-EU_
C202 C203 C206 C208 C209 C301-C304 C801 C802 = myRcl:C-EU_: CAPACITOR, European symbol
C401 C803 C804 = rcl:C-EU: CAPACITOR, European symbol
D201 D202 = LED:LED: LED OSRAM: - CHIPLED LG R971, LG N971, LY N971, LG Q971, LY Q971, LO R971, LY R971 LH N974, LH R974 LS Q976, LO Q976, LY Q976 LO Q996 - Hyper CHIPLED LW Q18S LB Q993, LB Q99A, LB R99A - SideLED LS A670, LO A670, LY A670, LG A670, LP A670 LB A673, LV A673, LT A673, LW A673 LH A674 LY A675 LS A676, LA A676, LO A676, LY A676, LW A676 LS A679, LY A679, LG A679 - Hyper Micro SIDELED® LS Y876, LA Y876, LO Y876, LY Y876 LT Y87S - SmartLED LW L88C, LW L88S LB L89C, LB L89S, LG L890 LS L89K, LO L89K, LY L89K LS L896, LA L896, LO L896, LY L896 - TOPLED LS T670, LO T670, LY T670, LG T670, LP T670 LSG T670, LSP T670, LSY T670, LOP T670, LYG T670 LG T671, LOG T671, LSG T671 LB T673, LV T673, LT T673, LW T673 LH T674 LS T676, LA T676, LO T676, LY T676, LB T676, LH T676, LSB T676, LW T676 LB T67C, LV T67C, LT T67C, LS T67K, LO T67K, LY T67K, LW E67C LS E67B, LA E67B, LO E67B, LY E67B, LB E67C, LV E67C, LT E67C LW T67C LS T679, LY T679, LG T679 LS T770, LO T770, LY T770, LG T770, LP T770 LB T773, LV T773, LT T773, LW T773 LH T774 LS E675, LA E675, LY E675, LS T675 LS T776, LA T776, LO T776, LY T776, LB T776 LHGB T686 LT T68C, LB T68C - Hyper Mini TOPLED® LB M676 - Mini TOPLED Santana® LG M470 LS M47K, LO M47K, LY M47K Source: http://www.osram.convergy.de LUXEON: - LUMILED® LXK2-PW12-R00, LXK2-PW12-S00, LXK2-PW14-U00, LXK2-PW14-V00 LXK2-PM12-R00, LXK2-PM12-S00, LXK2-PM14-U00 LXK2-PE12-Q00, LXK2-PE12-R00, LXK2-PE12-S00, LXK2-PE14-T00, LXK2-PE14-U00 LXK2-PB12-K00, LXK2-PB12-L00, LXK2-PB12-M00, LXK2-PB14-N00, LXK2-PB14-P00, LXK2-PB14-Q00 LXK2-PR12-L00, LXK2-PR12-M00, LXK2-PR14-Q00, LXK2-PR14-R00 LXK2-PD12-Q00, LXK2-PD12-R00, LXK2-PD12-S00 LXK2-PH12-R00, LXK2-PH12-S00 LXK2-PL12-P00, LXK2-PL12-Q00, LXK2-PL12-R00 Source: www.luxeon.com KINGBRIGHT: KA-3528ASYC Source: www.kingbright.com
D501-D507 D603 D604 D607 D608 D610 = diode:DIODE-: DIODE
D601 D602 D605 D606 D609 = diode:ZENER-DIODE: Z-Diode
DB201 = diode:DB104
F201 = fuse:GSH15: FUSE HOLDER grid 15mm, 19649 Wickmann
I601-I605 = optocoupler:PC814: SHARP OPTO COUPLER
IC201 = v-reg:78LXX: VOLTAGE REGULATOR
IC202 = myV-reg:78XXSC: VOLTAGE REGULATOR
IC401 = maxim:MAX34*: +5V, Fail-Safe, 40Mbps, Profibus RS-485/RS-422 Transceivers Source: MAX3465-MAX3469.pdf
IC701 = uln-udn:ULN2003A: DRIVER ARRAY
IC801 IC802 = myLinear:LM358M
K701-K705 = relay:351: RELAY 2 x switch, Omron
L201 = inductors:MICC12: INDUCTOR
LCD501 = display-lcd:JM204_SIZE: LCD: JM204
Q301 = crystal:CRYSTAL: CRYSTAL
R201 R202 R205-R207 R301 R501-R505 R601-R610 R801 R802 R807 R810 = myRcl:R-EU_: RESISTOR, European symbol
R203 R204 R401-R405 R803-R806 R808 R809 = rcl:R-EU_: RESISTOR, European symbol
RP201 RP202 = myRcl:RP-EU_
SL201 = con-amp-quick:M02: AMP QUICK CONNECTOR
SL301 SL502 = con-amp-quick:M06: AMP QUICK CONNECTOR
SL501 = con-amp-quick:M08: AMP QUICK CONNECTOR
SL503 = con-amp-quick:M04: AMP QUICK CONNECTOR
SW401 = special:SW_DIP-4: DIP SWITCH
TP1-TP6 = testpad:TP: Test pad
TR201 = trafo:EI38-2: TRANSFORMER 1 primary winding, 2 secondary windings ERA
TVS401-TVS403 = diode:B72500D
VR201 VR202 = v-reg:TL431CLP: VOLTAGE REGULATOR
X101 X103 = con-ptr500:AK500/6: CONNECTOR
X102 X104 = con-ptr500:AK500/7: CONNECTOR
X401 = con-thomas-betts:D-SUB9-: D-Subminiatur Connector Source: Electronioc Interconnects European Edition 1998

## Board
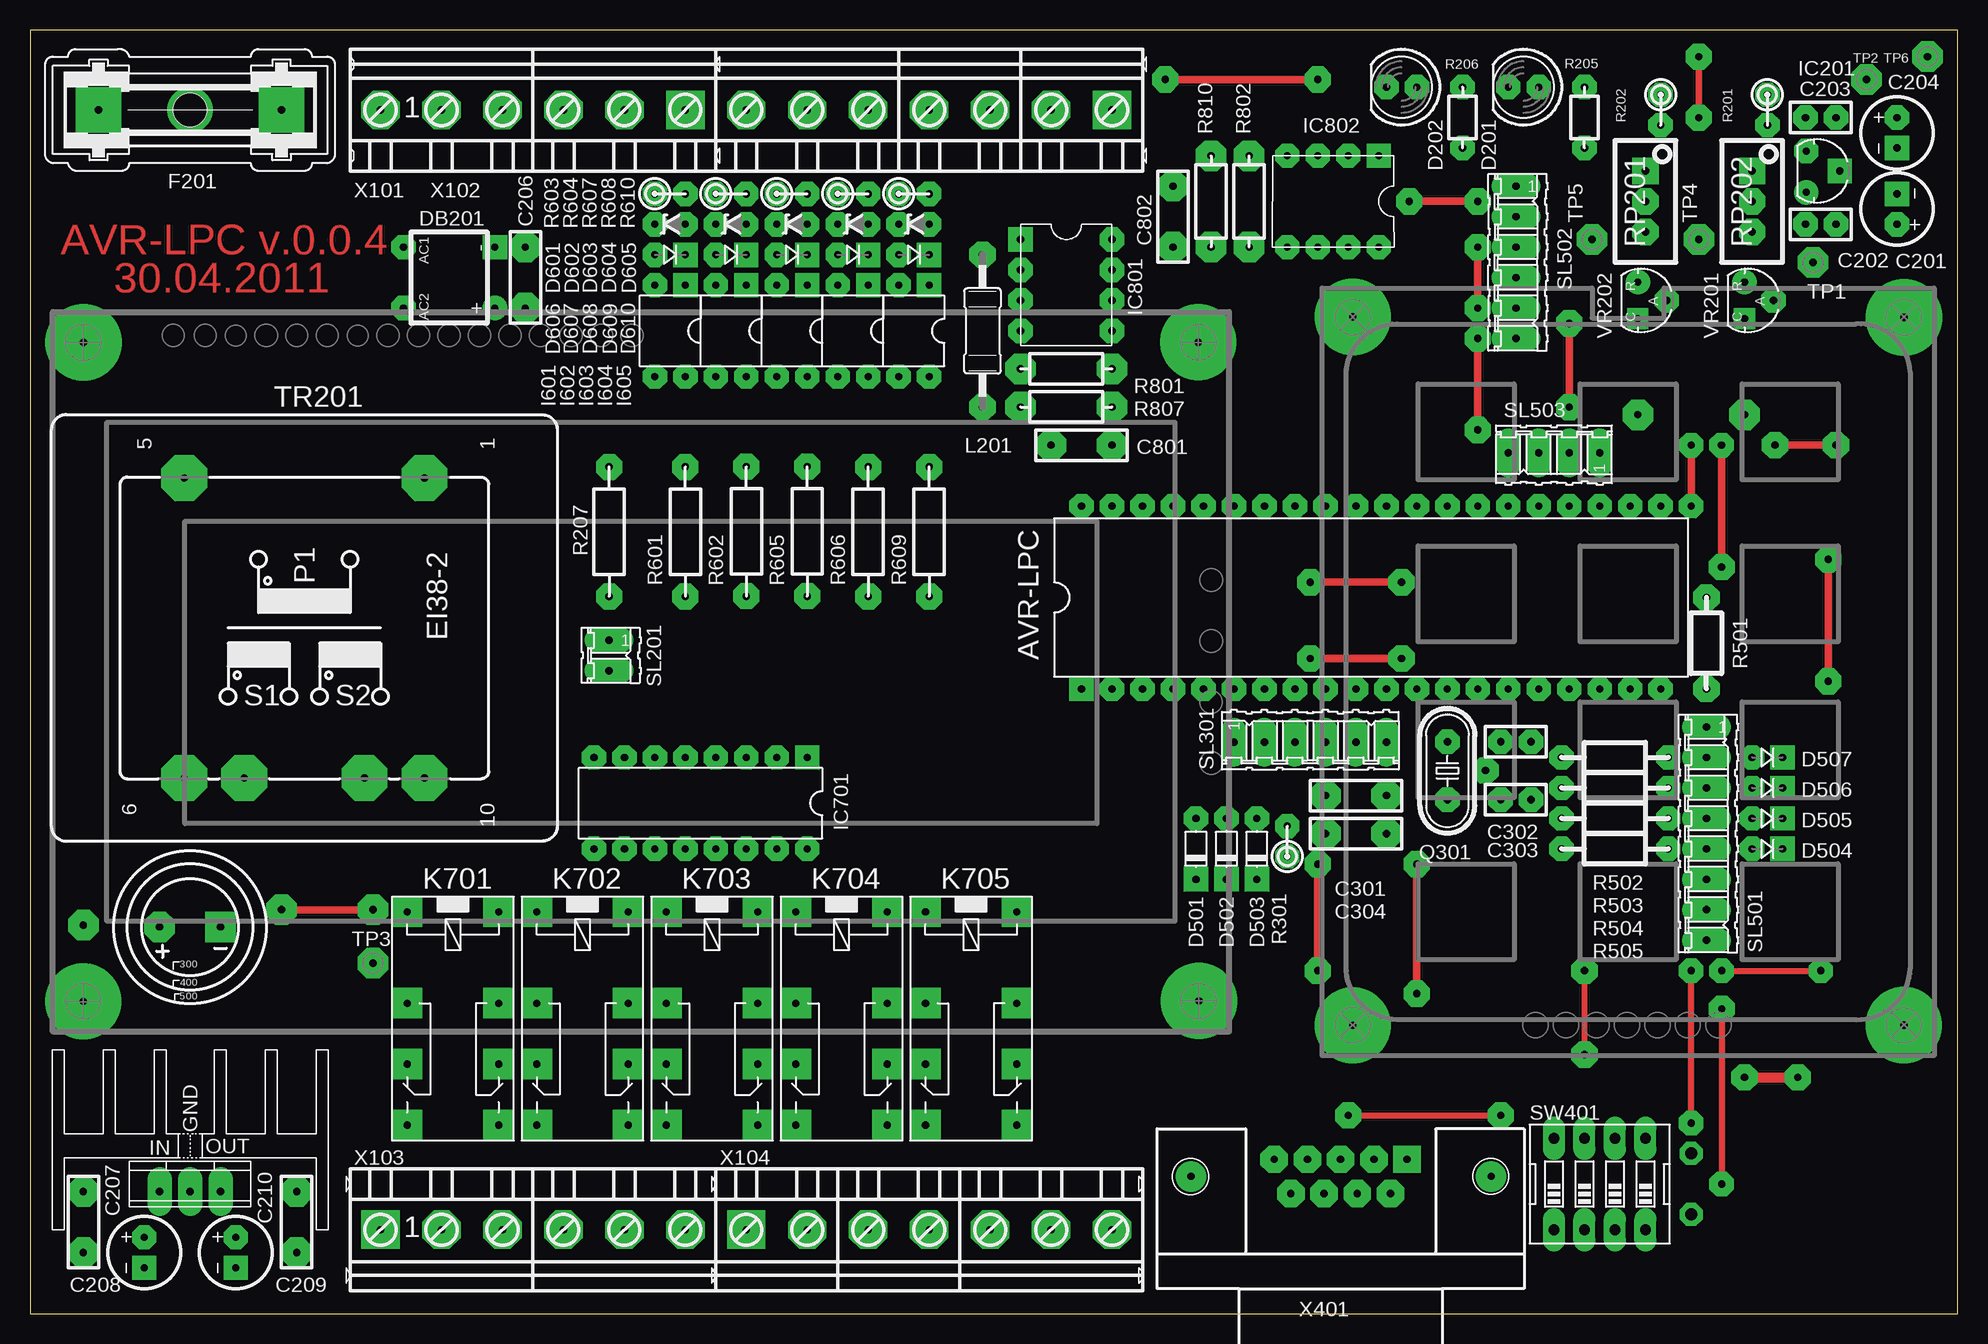
[diagram p8: board, top side]
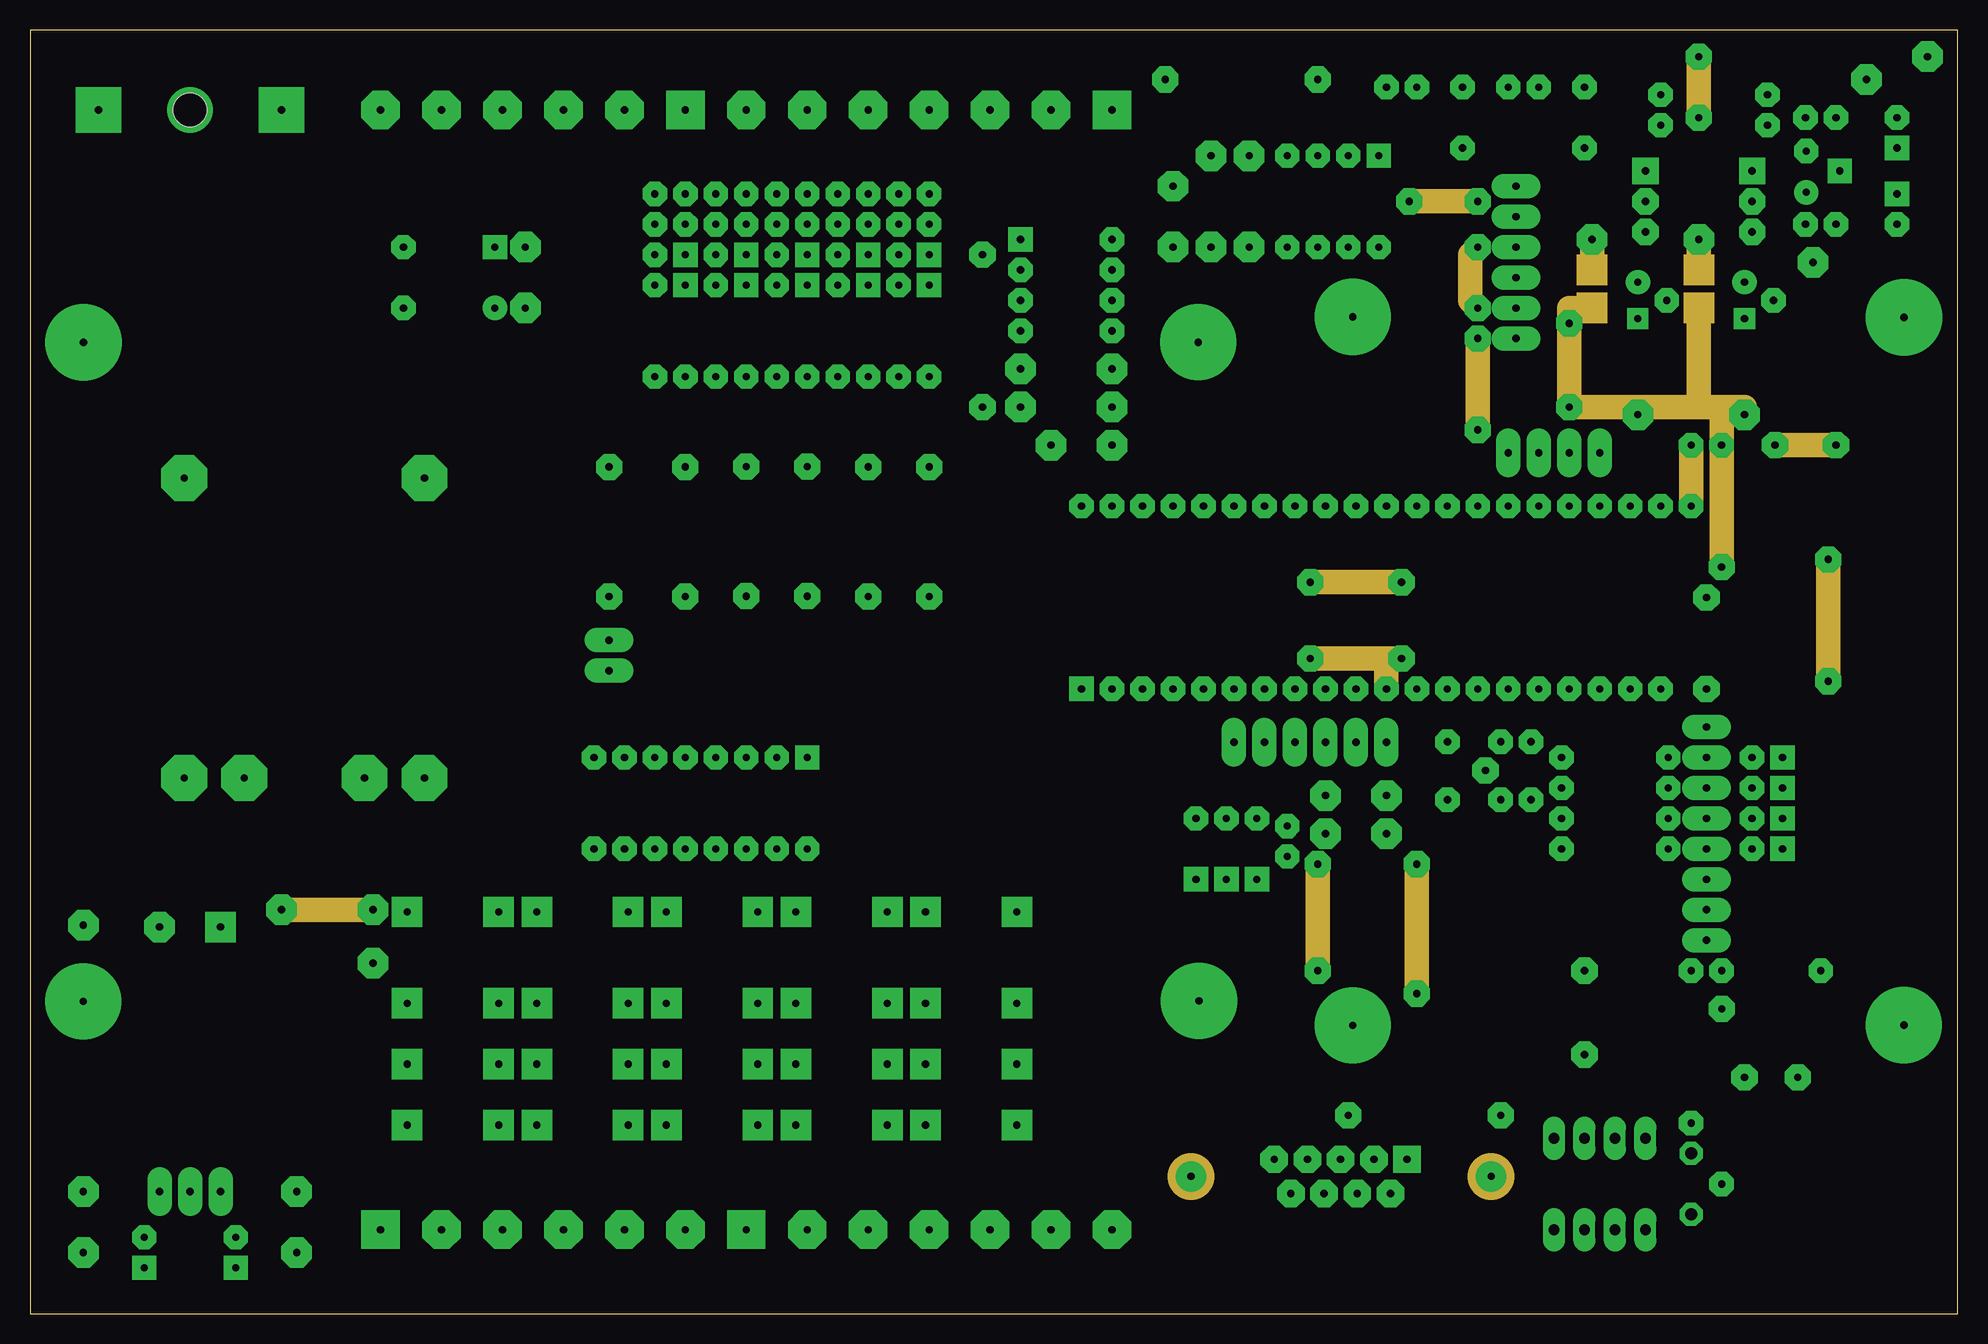
[diagram p9: board, inner layer Route15]
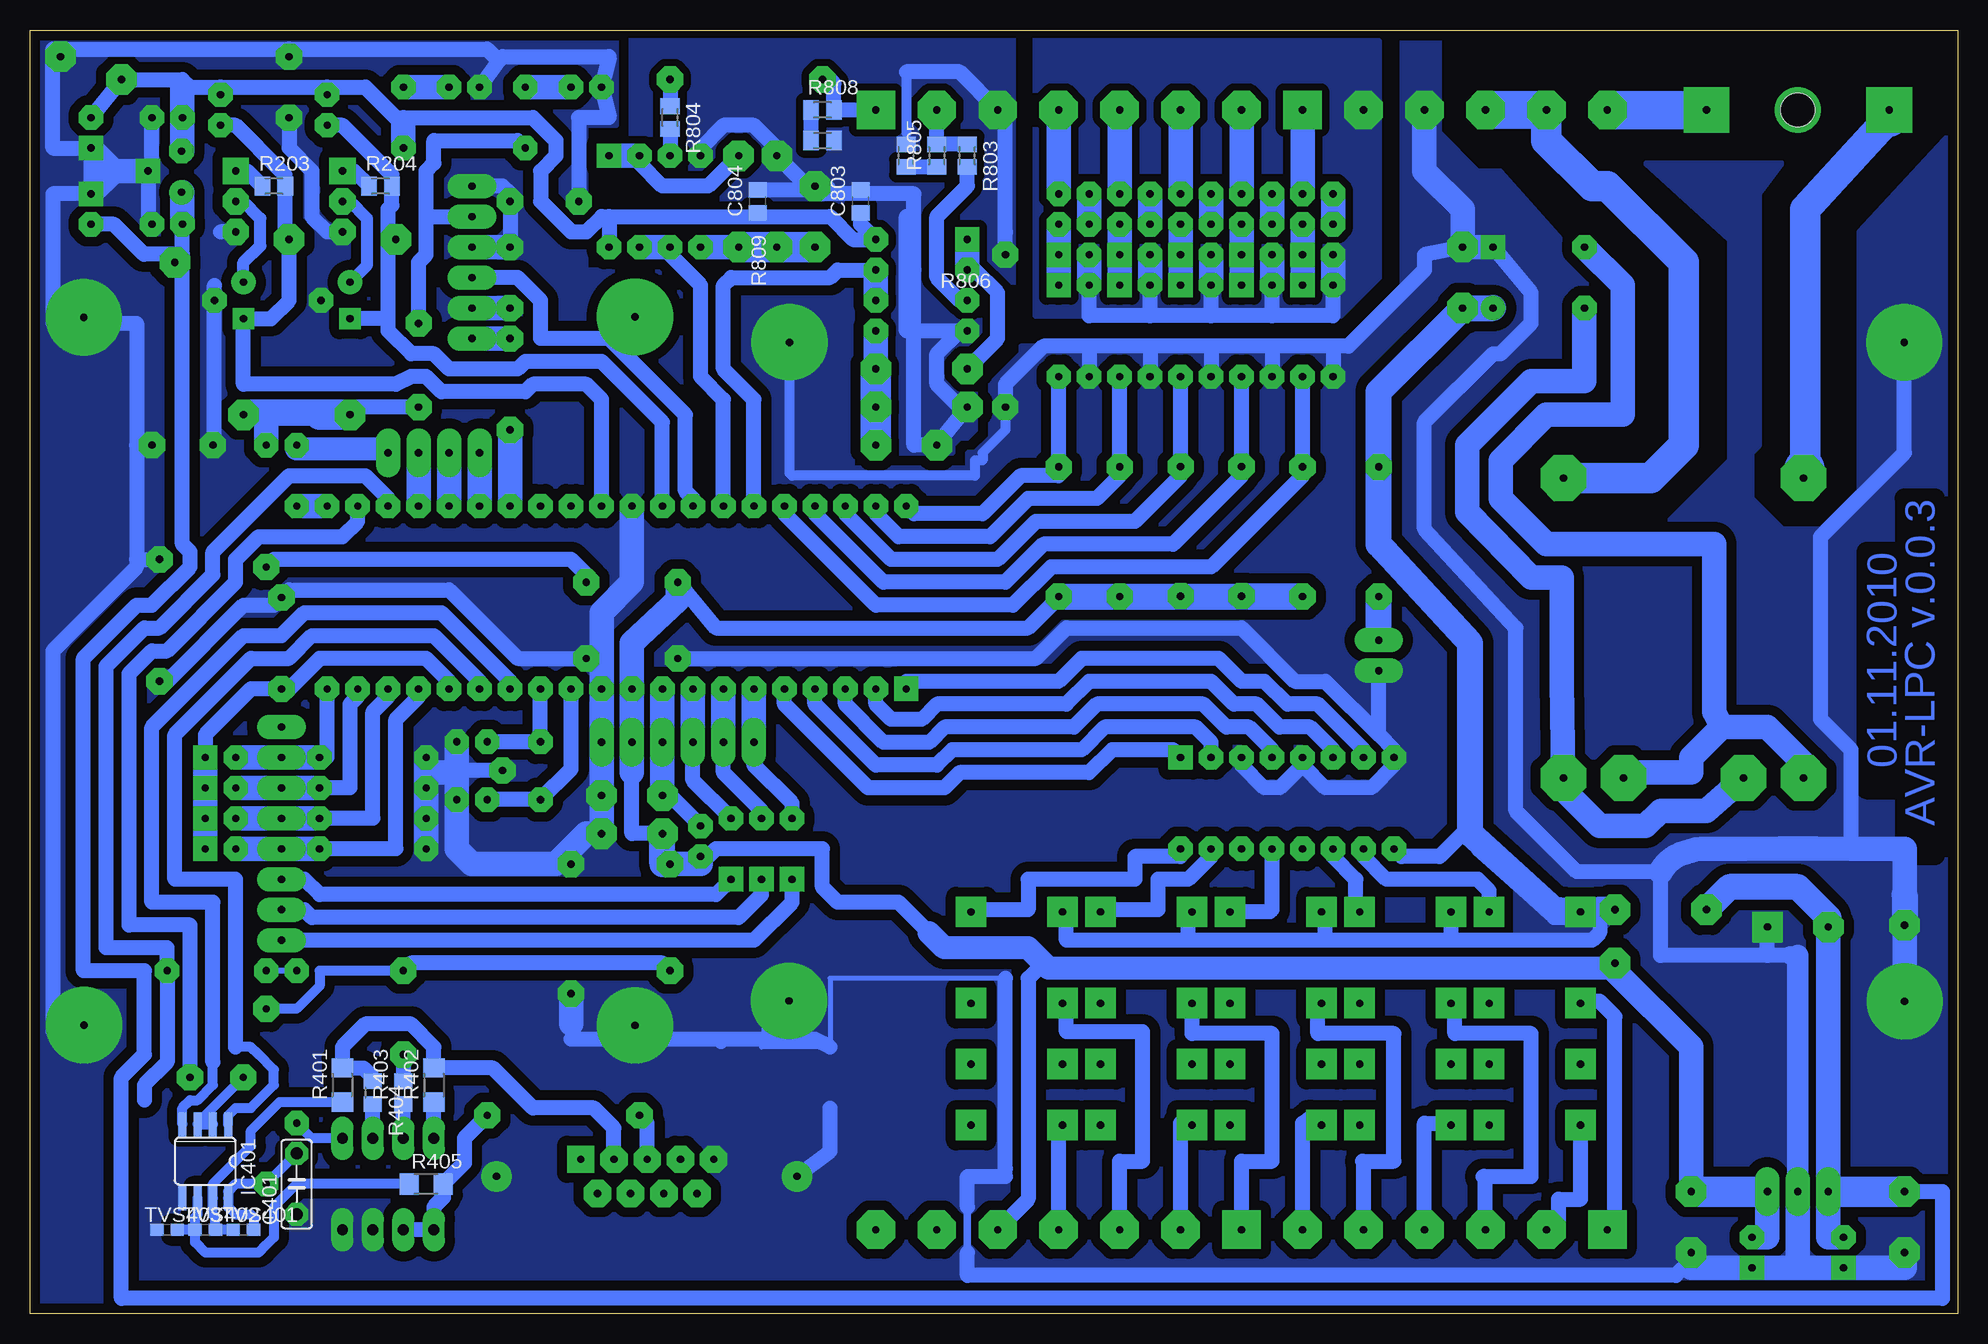
[diagram p10: board, bottom side, seen from below]

Size 160.66 x 107 mm. Coordinates in mm from the lower left corner, seen from the top.
Outline: 0,0 160.66,0 160.66,107 0.01,107 0,0
Copper layers (1*16): Top 0.035mm / dielectric 1.5mm / Bottom 0.035mm
Design rules "default *": minimum track width 50mil, minimum drill 31mil, track to track 25mil, track to pad 20mil, pad to pad 20mil, via to via 20mil, smd to smd 8mil, copper to edge 25mil, drill to drill 25mil, minimum pad ring 18mil, minimum via ring 8mil, stop-mask expansion 4mil, vias tented up to drill 0mil, thermal gap 10mil
bKeepout: 4 lines

### Footprints (pad centres in the part's own frame; a part is rotated, then mirrored left to right if it is on the bottom)
DIL40 = drill 0.61 pad 2.032 square: 1 -24.13,-7.62 | drill 0.61 pad 2.032 octagon: 2 -21.59,-7.62; 3 -19.05,-7.62; 4 -16.51,-7.62; 5 -13.97,-7.62; 6 -11.43,-7.62; 7 -8.89,-7.62; 8 -6.35,-7.62; 9 -3.81,-7.62; 10 -1.27,-7.62; 11 1.27,-7.62; 12 3.81,-7.62; 13 6.35,-7.62; 14 8.89,-7.62; 15 11.43,-7.62; 16 13.97,-7.62; 17 16.51,-7.62; 18 19.05,-7.62; 19 21.59,-7.62; 20 24.13,-7.62; 21 24.13,7.62; 22 21.59,7.62; 23 19.05,7.62; 24 16.51,7.62; 25 13.97,7.62; 26 11.43,7.62; 27 8.89,7.62; 28 6.35,7.62; 29 3.81,7.62; 30 1.27,7.62; 31 -1.27,7.62; 32 -3.81,7.62; 33 -6.35,7.62; 34 -8.89,7.62; 35 -11.43,7.62; 36 -13.97,7.62; 37 -16.51,7.62; 38 -19.05,7.62; 39 -21.59,7.62; 40 -24.13,7.62
CP100X80X24 = drill 0.61 pad 2.032 octagon: + -1.27,0 | drill 0.61 pad 2.032 square: - 1.27,0
C100X86X24 = drill 0.61 pad 2.032 octagon: P$1 -1.27,0; P$2 1.27,0
CP500/300X100X24 = drill 0.61 pad 2.54 octagon: + 2.54,0 | drill 0.61 pad 2.54 square: - -2.54,0
C200X100X24 = drill 0.61 pad 2.54 octagon: P$1 -2.54,0; P$2 2.54,0
C050-025X075 = drill 1 octagon: 1 -2.54,0; 2 2.54,0
C0805 = smd 1.3 x 1.5: 1 -0.95,0; 2 0.95,0
LED5MM = drill 0.61 pad 2.032 octagon: A -1.27,0; K 1.27,0
D-5 = drill 0.61 pad 2.032 octagon: A 2.54,0 | drill 0.61 pad 2.032 square: C -2.54,0
D-2.5 = drill 0.61 pad 2.032 octagon: A 1.27,0 | drill 0.61 pad 2.032 square: C -1.27,0
ZDIO-2.5 = drill 0.61 pad 2.032 octagon: A 1.27,0; C -1.27,0
DB104 = drill 0.61 pad 2.032 round: + 2.54,3.81 | drill 0.61 pad 2.032 square: - -2.54,3.81 | drill 0.61 pad 2.032 octagon: AC1 -2.54,-3.81; AC2 2.54,-3.81
GSH15 = drill 0.61 pad 3.81 square: 1 -7.62,0; 2 7.62,0 | drill 0.61 pad 3.81 round: P$1 0,0 | hole 2.794: 0,0
DIL04 = drill 0.61 pad 2.032 square: 1 -1.27,-3.81 | drill 0.61 pad 2.032 octagon: 2 1.27,-3.81; 3 1.27,3.81; 4 -1.27,3.81
78LXX = drill 0.61 pad 2.032 square: GND 0,1.905 | drill 0.61 pad 2.032 round: IN 1.778,-0.889 | drill 0.61 pad 2.032 octagon: OUT -1.651,-0.889
78XX_VERTICAL_COOLER = drill 0.61 pad 2.032 long: GND 0,-2.54; IN -2.54,-2.54; OUT 2.54,-2.54
SO08 = smd 0.66 x 2.032: 1 -1.905,-3.073; 2 -0.635,-3.073; 3 0.635,-3.073; 4 1.905,-3.073; 5 1.905,3.073; 6 0.635,3.073; 7 -0.635,3.073; 8 -1.905,3.073
DIL16 = drill 0.61 pad 2.032 square: 1 -8.89,-3.81 | drill 0.61 pad 2.032 octagon: 2 -6.35,-3.81; 3 -3.81,-3.81; 4 -1.27,-3.81; 5 1.27,-3.81; 6 3.81,-3.81; 7 6.35,-3.81; 8 8.89,-3.81; 9 8.89,3.81; 10 6.35,3.81; 11 3.81,3.81; 12 1.27,3.81; 13 -1.27,3.81; 14 -3.81,3.81; 15 -6.35,3.81; 16 -8.89,3.81
DIL8 = drill 0.61 pad 2.032 square: 1 -3.81,-3.81 | drill 0.61 pad 2.032 octagon: 2 -1.27,-3.81; 3 1.27,-3.81; 4 3.81,-3.81; 5 3.81,3.81; 6 1.27,3.81; 7 -1.27,3.81; 8 -3.81,3.81
351 = drill 0.61 pad 2.54 square: 1 -3.81,-3.81; 16 -3.81,3.81; O1 8.89,-3.81; O2 8.89,3.81; P1 3.81,-3.81; P2 3.81,3.81; S1 13.97,-3.81; S2 13.97,3.81
MICC12 = drill 0.61 pad 2.184 octagon: 1 -6.35,0; 2 6.35,0
HC49U-V = drill 0.61 pad 2.032 octagon: 1 -2.413,0; 2 2.413,0
R100X86X24 = drill 0.61 pad 2.032 octagon: P$1 -1.27,0; P$2 1.27,0
M0805 = smd 1.3 x 1.6: 1 -0.95,0; 2 0.95,0
R200X86X24 = drill 0.61 pad 2.032 octagon: P$1 -2.54,0; P$2 2.54,0
R425X86X24 = drill 0.61 pad 2.184 octagon: P$1 -5.397,0; P$2 5.397,0
R1206 = smd 1.6 x 1.803: 1 -1.422,0; 2 1.422,0
R0805 = smd 1.3 x 1.5: 1 -0.95,0; 2 0.95,0
R300X86X24 = drill 0.61 pad 2.184 octagon: P$1 -3.81,0; P$2 3.81,0
R350X86X24 = drill 0.61 pad 2.032 octagon: P$1 -4.445,0; P$2 4.445,0
R300X100X24 = drill 0.61 pad 2.54 octagon: P$1 -3.81,0; P$2 3.81,0
RP0 = drill 0.61 pad 2.184 square: 1 -2.54,0 | drill 0.61 pad 2.184 octagon: 2 0,0; 3 2.54,0
02P = drill 0.61 pad 2.032 long: 1 -1.27,0; 2 1.27,0
06P = drill 0.61 pad 2.032 long: 1 -6.35,0; 2 -3.81,0; 3 -1.27,0; 4 1.27,0; 5 3.81,0; 6 6.35,0
08P = drill 0.61 pad 2.032 long: 1 -8.89,0; 2 -6.35,0; 3 -3.81,0; 4 -1.27,0; 5 1.27,0; 6 3.81,0; 7 6.35,0; 8 8.89,0
04P = drill 0.61 pad 2.032 long: 1 -3.81,0; 2 -1.27,0; 3 1.27,0; 4 3.81,0
EDG-04 = drill 0.9 long: 1 -3.81,-3.81; 2 -1.27,-3.81; 3 1.27,-3.81; 4 3.81,-3.81; 5 3.81,3.81; 6 1.27,3.81; 7 -1.27,3.81; 8 -3.81,3.81
P1-17 = drill 0.61 pad 2.54 octagon: TP 0,0
EI38-2 = drill 0.61 pad 3.81 octagon: 1 -12.497,10.008; 5 -12.497,-10.008; 6 12.497,-10.008; 7 12.497,-5.004; 9 12.497,5.004; 10 12.497,10.008
D0603 = smd 1.1 x 1: 1 -0.85,0; 2 0.85,0
TO92-CLP = drill 0.61 pad 2.032 octagon: A 0,2.159 | drill 0.61 pad 1.778 square: C 1.524,-0.254 | drill 0.61 pad 2.032 round: R -1.524,-0.254
AWG/6-H = drill 0.61 pad 3.2 square: 1 12.7,0 | drill 0.61 pad 3.2 octagon: 2 7.62,0; 3 2.54,0; 4 -2.54,0; 5 -7.62,0; 6 -12.7,0
AWG/7-H = drill 0.61 pad 3.2 square: 1 15.24,0 | drill 0.61 pad 3.2 octagon: 2 10.16,0; 3 5.08,0; 4 0,0; 5 -5.08,0; 6 -10.16,0; 7 -15.24,0
H3R09RA = drill 0.61 pad 2.286 square: 1 5.537,1.422 | drill 0.61 pad 2.286 octagon: 2 2.769,1.422; 3 0,1.422; 4 -2.769,1.422; 5 -5.537,1.422; 6 4.153,-1.422; 7 1.384,-1.422; 8 -1.384,-1.422; 9 -4.153,-1.422

### Placement (x,y rotation side)
AVR-LPC  111.76,59.69 0 top
C201  155.57,92.08 90 top
C202  149.22,90.81 0 top
C203  149.22,99.69 0 top
C204  155.57,98.42 270 top
C205  13.34,32.22 180 top
C206  41.27,86.36 90 top
C207  9.53,5.08 270 top
C208  4.45,7.62 270 top
C209  22.23,7.62 270 top
C210  17.14,5.08 270 top
C301  110.49,43.18 0 top
C302  123.83,42.84 0 top
C303  123.83,47.66 0 top
C304  110.49,40.01 0 top
C401  138.43,10.79 90 bottom
C801  87.63,72.39 180 top
C802  95.25,91.44 90 top
C803  91.44,92.71 90 bottom
C804  100.01,92.71 90 bottom
D201  124.46,102.23 180 top
D202  114.3,102.23 180 top
D501  97.16,38.73 90 top
D502  99.69,38.73 90 top
D503  102.23,38.73 90 top
D504  144.78,38.73 180 top
D505  144.78,41.27 180 top
D506  144.78,43.81 180 top
D507  144.78,46.35 180 top
D601  53.34,90.81 0 top
D602  58.42,90.81 0 top
D603  53.34,88.27 180 top
D604  58.42,88.27 180 top
D605  63.5,90.81 0 top
D606  68.58,90.81 0 top
D607  63.5,88.27 180 top
D608  68.58,88.27 180 top
D609  73.66,90.81 0 top
D610  73.66,88.27 180 top
DB201  34.92,86.36 270 top
F201  13.34,100.33 180 top
I601  53.34,81.92 180 top
I602  58.42,81.92 180 top
I603  63.5,81.92 180 top
I604  68.58,81.92 180 top
I605  73.66,81.92 180 top
IC201  148.91,95.25 270 top
IC202  13.34,12.7 0 top
IC401  146.05,12.7 180 bottom
IC701  55.88,42.55 180 top
IC801  86.36,85.72 270 top
IC802  108.58,92.71 180 top
K701  35.24,29.67 270 top
K702  46.04,29.67 270 top
K703  56.84,29.67 270 top
K704  67.63,29.67 270 top
K705  78.42,29.67 270 top
L201  79.38,81.92 90 top
LCD501  1.91,23.5 0 top
Q301  118.11,45.25 90 top
R201  144.78,100.33 90 top
R202  135.89,100.33 90 top
R203  140.34,93.98 0 bottom
R204  131.44,93.98 0 bottom
R205  129.54,99.69 270 top
R206  119.38,99.69 270 top
R207  48.26,65.18 90 top
R301  104.78,39.37 270 top
R401  134.62,19.05 90 bottom
R402  127,19.05 90 bottom
R403  129.54,18.41 90 bottom
R404  132.08,18.41 270 bottom
R405  127.64,10.79 0 bottom
R501  139.7,55.88 270 top
R502  132.08,46.35 0 top
R503  132.08,43.81 0 top
R504  132.08,41.27 0 top
R505  132.08,38.73 0 top
R601  54.61,65.18 270 top
R602  59.69,65.2 270 top
R603  53.34,93.34 180 top
R604  58.42,93.34 180 top
R605  64.77,65.2 270 top
R606  69.85,65.18 270 top
R607  63.5,93.34 180 top
R608  68.58,93.34 180 top
R609  74.93,65.18 270 top
R610  73.66,93.34 180 top
R801  86.36,78.74 180 top
R802  101.6,92.71 90 top
R803  82.55,96.52 270 bottom
R804  107.31,99.69 270 bottom
R805  85.09,96.52 90 bottom
R806  87.63,96.52 270 bottom
R807  86.36,75.56 0 top
R808  94.61,100.33 0 bottom
R809  94.61,97.79 180 bottom
R810  98.42,92.71 270 top
RP201  143.51,92.71 270 top
RP202  134.62,92.71 270 top
SL201  48.26,54.86 270 top
SL301  106.68,47.62 0 top
SL501  139.7,40.01 270 top
SL502  123.83,87.63 270 top
SL503  127,71.75 180 top
SW401  130.81,10.79 0 top
TP1  148.59,87.63 0 top
TP2  153.03,102.87 0 top
TP3  28.57,29.21 0 top
TP4  139.06,89.53 0 top
TP5  130.18,89.53 0 top
TP6  158.12,104.78 0 top
TR201  22.86,57.15 270 top
TVS401  142.88,6.99 0 bottom
TVS402  146.05,6.99 0 bottom
TVS403  149.22,6.99 0 bottom
U$1  [M-3X4]  107.68,21.5 0 top
VR201  143.13,84.45 270 top
VR202  134.24,84.45 270 top
X101  41.91,100.33 0 top
X102  74.93,100.33 0 top
X103  41.91,6.99 180 top
X104  74.93,6.99 180 top
X401  109.22,11.43 0 top

### Tracks (layer width: path | path; a pad name or v marks a point on that pad's centre or on a via)
+5V  (via drill 0.6 pad 2.03, 0.6 pad 2.18, 0.61 pad 2.03, 0.61 pad 2.18, 0.61 pad 2.54)
  Top 0.508: v129.54,28.57 v129.54,21.59 | v140.97,25.4 v140.97,10.79
  Top 0.61: v106.68,60.96 v114.3,60.96 | v140.97,62.23 v140.97,72.39 | v107.31,37.47 v107.31,28.57 | v128.27,75.56 v128.27,82.55
  Route15 2.032: v107.31,37.47 v107.31,28.57 | v140.97,62.23 v140.97,72.39 140.97,75.56 | v106.68,60.96 v114.3,60.96 | 133.99,75.56 v133.99,74.93 | 133.99,75.56 v128.27,75.56 v128.27,82.55 128.27,83.82 130.18,83.82 | 140.97,75.56 142.88,75.56 v142.88,74.93 | 140.97,75.56 139.06,75.56 | 139.06,75.56 133.99,75.56 | 139.06,75.56 139.06,83.82
  Bottom 0.406: TP3.TP 28.78,29.21 28.78,28.78
  Bottom 0.813: TVS401.2 142.03,8.04 142.24,8.26 143.51,8.26 144.15,8.89 IC401.8 144.15,10.16 143.51,10.79 v140.97,10.79 C401.2 | v129.54,28.57 136.53,28.57 136.53,27.3 138.43,25.4 v140.97,25.4
  Bottom 1.27: v114.3,60.96 114.3,61.59 115.57,62.87 140.34,62.87 v140.97,62.23 | R301.P$2 104.14,38.1 103.5,38.73 94.61,38.73 94.61,35.56 93.34,34.29 88.27,34.29 85.72,31.75 | C304.P$1 110.49,40.01 110.49,45.09 | v107.31,28.57 107.95,29.21 128.91,29.21 v129.54,28.57 | v133.99,74.93 133.99,75.56 v128.27,75.56 | 140.97,74.93 v142.88,74.93 | 74.84,59.78 77.47,57.15 103.5,57.15 v106.68,60.96 | v128.27,82.55 128.27,87.63 127.64,88.27 127.64,91.44 | 127.64,91.44 SL502.2 | 127.64,91.44 127.64,95.25 127,95.89 127,97.79 120.02,97.79 R206.P$2 | X104.5 77.47,9.53 77.47,27.94 76.2,29.21 | IC202.OUT 16.51,10.16 | v129.54,21.59 R403.2
  Bottom 1.905: 136.84,75.09 136.53,74.93 | v142.88,74.93 142.56,75.09 | 85.72,31.75 84.45,30.48 77.47,30.48 76.2,29.21 75.77,28.78 28.78,28.78 28.57,28.57
  Bottom 2.032: IC202.OUT 15.88,6.35 C210.+ | v106.68,60.96 106.68,59.46 110.49,55.88 AVR-LPC.10 SL301.5 110.49,45.09 | C209.P$1 22.23,22.23 28.57,28.57 | R301.P$2 104.78,37.47 v107.31,37.47 | v140.97,72.39 140.97,74.93
  Bottom 2.184: R606.P$2 64.8,59.78 R605.P$2 | R606.P$2 R601.P$2 59.66,59.78 R602.P$2 | R609.P$2 74.84,59.78 R606.P$2 | v107.31,37.47 107.95,37.47 C304.P$1
  Bottom 2.222: 142.56,75.09 136.84,75.09
  Bottom 2.54: v133.99,74.93 136.53,74.93 | 16.51,10.16 C209.P$1
+12V
  Bottom 0.025: 129.54,99.69 129.54,99.06
  Bottom 1.27: 147.96,102.87 TP2.TP C204.+ | 147.96,102.87 147.96,102.23 | 112.39,91.44 113.03,91.44 114.3,90.17 115.57,90.17 118.11,92.71 118.11,95.25 116.84,96.52 116.84,97.79 118.75,99.69 129.54,99.69 130.18,99.69 132.72,102.23 135.89,102.23 | 112.39,91.44 IC802.8 | 112.39,91.44 99.69,91.44 | 99.69,91.44 93.98,91.44 92.08,89.53 IC801.8 91.44,90.81 C803.1 | 147.96,102.87 147.32,102.23 144.78,102.23 | 135.89,102.23 R202.P$2 | 144.78,102.23 135.89,102.23 | 144.78,102.23 R201.P$2 | C804.1 99.69,91.44
  Bottom 2.032: IC201.OUT 147.96,96.9 C203.P$1 147.96,102.23 | 129.54,99.06 R205.P$2
+15V  (via drill 0.61 pad 2.54)
  Top 0.61: v20.95,33.66 v28.57,33.66
  Route15 2.032: v20.95,33.66 v28.57,33.66
  Bottom 1.27: 42.55,31.11 30.48,31.11 29.84,31.75 29.84,33.02 33.02,33.02 33.66,33.02 31.75,33.16 K701.1 32.38,33.66 33.66,33.66 34.29,33.66 40.01,38.73 | 42.55,31.11 42.23,31.43 K702.1 | K703.1 52.7,33.16 52.7,31.11 | 42.55,31.11 52.7,31.11 | K704.1 64.14,33.16 64.14,31.11 | 52.7,31.11 64.14,31.11 | 74.3,33.02 74.3,33.16 K705.1 74.3,33.02 | 64.14,31.11 74.3,31.11 74.3,33.02 | C208.P$1 1.27,10.16 1.27,1.27 153.03,1.27 153.03,19.68 151.13,21.59 151.13,28.57 156.21,28.57 156.21,54.61 151.76,59.05 150.5,59.05 147.32,62.23 147.32,63.5 147.96,64.14 147.96,87.63 147.95,88.27 147.95,88.3 | 147.95,88.3 148.59,88.3 | 148.59,88.3 151.16,88.3 153.67,90.81 C201.+ | 147.95,88.3 147.95,90.17 C202.P$1 | 10.16,10.16 IC202.IN | R207.P$2 48.26,71.12 | IC701.9 46.35,38.1 43.18,38.1 40.64,40.64 | 148.59,88.3 TP1.TP
  Bottom 2.032: C207.+ 10.79,6.35 IC202.IN C205.+ | IC201.IN 147.96,93.47 C202.P$1
  Bottom 2.184: 48.26,71.12 48.26,76.83 C206.P$1 DB201.+ | v20.95,33.66 19.05,35.56 13.34,35.56 10.79,33.02 C205.+ | v28.57,33.66 29.21,33.66 29.84,33.66 K701.1 33.66,33.66 40.64,40.01 40.64,40.64 40.64,55.88 48.26,64.14 R207.P$2
  Bottom 2.54: C208.P$1 10.16,10.16
  pour Bottom (no thermals): 36.83,31.11 36.83,37.47 33.66,34.29 29.21,34.29 29.21,32.38 30.48,31.11
AGND
  Bottom 0.838: 87.63,103.5 87.63,98.42 | C802.P$2 93.98,93.98
  Bottom 1.27: C802.P$2 95.89,93.98 R810.P$1 98.42,97.16 100.33,99.06 102.87,99.06 104.78,97.16 IC802.4 | 87.63,91.44 87.63,81.92 83.82,81.92 IC801.4 83.19,81.92 85.09,80.01 85.09,78.11 85.09,77.47 83.19,75.56 R807.P$1 C801.P$2 87,72.39 87,87 87,93.34 94.61,93.34 C802.P$2 | L201.2 79.38,90.14 | 79.38,90.14 79.38,90.17 | 87.63,103.5 83.19,103.5 X102.3 79.38,99.69 79.38,90.14 | C804.2 95.57,93.66 C802.P$2
  pour Bottom (no thermals): 78.74,82.55 78.74,106.68 110.49,106.68 110.49,97.79 113.03,97.79 113.03,88.27 90.81,88.27 90.81,71.75 83.82,71.75 83.82,72.39 83.19,73.03 82.55,73.03 81.92,73.66 81.92,77.47 79.38,80.01 79.38,81.92
AI0
  Bottom 1.27: X102.2 R805.2 R803.1
AI1  (via drill 0.6 pad 2.18)
  Top 0.61: v94.61,102.87 v107.31,102.87
  Bottom 1.27: X102.1 90.81,100.33 R808.2 93.67,102.56 93.98,102.87 v94.61,102.87 | v107.31,102.87 R804.1
AIN_PUT0
  Bottom 1.27: AVR-LPC.35 100.33,76.2 102.87,78.74 102.87,85.72 102.23,86.36 93.98,86.36 93.34,87 IC801.7
  Bottom 2.032: IC801.7 IC801.6
AIN_PUT1
  Bottom 1.27: AVR-LPC.34 102.87,76.2 104.78,78.11 104.78,85.72 107.31,88.27 IC802.6
  Bottom 2.032: IC802.6 IC802.7
AREF
  Route15 2.032: TP5.TP 130.18,87
  Bottom 1.27: 130.81,82.93 130.81,82.55 130.81,81.92 128.91,80.01 127,80.01 125.73,78.74 120.02,78.74 119.38,79.38 113.03,79.38 107.95,74.3 AVR-LPC.32 | 130.81,82.93 130.81,83.82 | 130.81,83.82 130.81,89.53 | 130.81,89.53 130.81,92.08 130.5,92.39 R204.2 130.5,94.94 130.81,95.25 134.62,99.06 R202.P$1 | 130.81,82.93 130.81,83.82 | 130.81,82.93 VR202.C | 130.81,89.53 TP5.TP
AVCC
  Route15 2.032: TP4.TP 139.06,87
  Bottom 1.27: R201.P$1 143.51,99.06 139.7,95.25 139.38,94.94 R203.2 139.38,89.86 TP4.TP 139.06,84.45 140.59,82.93 VR201.C 142.88,77.47 130.18,77.47 128.91,78.11 127.64,78.11 126.36,76.83 119.38,76.83 118.75,77.47 114.3,77.47 113.03,76.2 113.03,73.66 AVR-LPC.30
BOOT  (via drill 0.6 pad 2.03)
  Top 0.508: v138.43,15.88 v138.43,28.57 | v140.97,28.57 v149.22,28.57
  Bottom 0.508: v138.43,28.57 v140.97,28.57
  Bottom 0.813: SW401.5 137.16,14.61 v138.43,15.88
  Bottom 1.27: AVR-LPC.23 130.81,67.94 132.72,69.85 139.06,69.85 145.41,63.5 145.41,61.59 149.86,57.15 151.13,57.15 154.31,53.98 154.31,30.48 149.22,30.48 v149.22,28.57 149.22,20.95 151.13,19.05 151.13,17.78
BUS+  (via drill 0.6 pad 2.18)
  Top 0.508: v109.86,16.51 v122.56,16.51
  Bottom 1.27: SW401.2 SW401.1 127,8.89 126.21,9.68 R405.2 124.46,12.55 124.46,14.61 v122.56,16.51 | X401.3 109.22,15.88 v109.86,16.51
BUS-
  Bottom 1.27: X401.2 111.99,15.47 113.67,17.14 118.75,17.14 121.92,20.32 122.07,20.47 R402.2 127,22.23 128.91,24.13 132.72,24.13 134.62,22.23 R401.2 | R401.2 134.62,20.32 | R404.1 132.08,19.68 132.72,20.32 132.87,20.47 R401.2
COL0_ISP_MOSI
  Bottom 1.27: D501.A 97.16,42.55 100.33,45.72 SL301.1
  Bottom 2.032: SL301.1 AVR-LPC.6
COL1_ISP_MISO
  Bottom 1.27: D502.A 99.69,41.91 102.87,45.09 SL301.2
  Bottom 2.032: SL301.2 AVR-LPC.7
COL2_ISP_SCK
  Bottom 1.27: D503.A 105.41,44.45 SL301.3
  Bottom 2.032: SL301.3 AVR-LPC.8
DATA0  (via drill 0.61 pad 2.03)
  Top 0.61: v138.43,72.39 v138.43,67.31
  Route15 2.032: v138.43,72.39 v138.43,67.31
  Bottom 1.27: SL503.1 130.81,72.07
  Bottom 1.905: v138.43,72.39 138.43,72.07 130.81,72.07
  Bottom 2.032: v138.43,67.31 AVR-LPC.21
DATA1
  Bottom 2.032: AVR-LPC.24 SL503.2
DATA2
  Bottom 2.032: AVR-LPC.25 SL503.3
DATA3
  Bottom 2.032: AVR-LPC.26 SL503.4
EN  (via drill 0.61 pad 2.18)
  Top 0.61: v120.65,73.66 v120.65,81.28
  Route15 2.032: v120.65,73.66 v120.65,81.28
  Bottom 2.032: AVR-LPC.27 v120.65,73.66 | v120.65,81.28 SL502.6
GND  (via drill 0.6 pad 2.18, 0.61 pad 2.18, 0.61 pad 2.54, 0.61 pad 6.35)
  Top 0.559: v139.06,104.78 v139.06,99.69
  Top 0.61: v106.68,54.61 v114.3,54.61 | v115.57,26.67 v115.57,37.47 | v149.86,62.87 v149.86,52.7 | v150.5,72.39 v145.41,72.39 | v120.65,88.9 v120.65,83.82 | v114.94,92.71 v120.65,92.71
  Route15 2.032: v115.57,26.67 v115.57,37.47 | v149.86,62.87 v149.86,52.7 | v150.5,72.39 v145.41,72.39 | v120.65,88.9 120.02,88.27 120.02,84.45 v120.65,83.82 | v114.94,92.71 v120.65,92.71 | v139.06,104.78 v139.06,99.69 | 113.03,54.61 v106.68,54.61 | 113.03,54.61 v114.3,54.61 | AVR-LPC.11 113.03,54.61
  Bottom 0.406: 82.55,6.99 82.55,11.43 80.01,11.43 79.38,12.06 | 79.38,27.94 93.98,27.94 93.98,22.23 99.69,22.23 99.69,22.86
  Bottom 0.635: 82.55,5.08 82.55,6.99 82.55,8.89
  Bottom 0.838: v97.36,80.97 97.36,70.06 97.16,69.85 81.92,69.85 81.92,71.12 81.28,71.12 81.28,71.75 79.38,73.66 79.38,76.2
  Bottom 1.27: 52.07,80.64 I601.3 | 52.07,80.64 57.15,80.64 | 57.15,80.64 I602.3 | 57.15,80.64 62.23,80.64 | 62.23,80.64 I603.3 | 62.23,80.64 67.31,80.64 | 67.31,80.64 72.39,80.64 | 72.39,80.64 I605.3 | 67.31,80.64 I604.3 | 113.03,54.61 120.02,54.61 125.73,60.33 139.06,60.33 R501.P$1 140.34,59.05 142.88,59.05 149.22,52.7 v149.86,52.7 | 151.76,72.39 151.76,62.87 | v156.16,24.04 155.42,23.5 | 155.57,23.5 158.75,23.5 158.75,55.24 151.76,62.23 151.76,62.87 | 151.76,62.87 v149.86,62.87 | DB201.- 35.56,85.09 35.56,82.55 38.1,80.01 38.73,80.01 44.45,74.3 44.45,65.41 36.83,57.15 36.83,41.91 31.75,36.83 24.77,36.83 24.77,29.84 15.88,29.84 | v4.46,80.96 4.46,71.74 11.43,64.77 11.43,49.53 8.89,46.99 8.89,38.73 | v145.41,72.39 145.29,72.52 VR201.A 145.29,85.72 | 151.76,72.39 v150.5,72.39 | 151.76,72.39 151.76,82.55 156.17,82.55 | 156.17,82.55 v156.17,83.05 | 156.17,82.55 158.75,82.55 158.75,93.34 C201.- C204.- 158.75,97.16 158.75,105.41 139.06,105.41 | RP202.3 135.89,90.17 137.16,91.44 137.16,95.25 139.06,97.16 v139.06,99.69 | RP201.3 144.78,90.17 | C202.P$2 150.81,90.81 IC201.GND 150.5,95.25 C203.P$2 | 121.6,104.46 121.28,104.78 112.39,104.78 D202.K 112.39,99.69 114.94,99.69 v114.94,92.71 | 121.6,104.46 D201.K | 115.57,22.86 109.22,22.86 109.22,23.76 v110.23,24.02 108.96,23.24 108.58,22.86 102.87,22.86 | 99.06,22.86 99.69,22.86 102.87,22.86 | 99.06,22.86 99.06,25.68 v97.41,26.06 | 99.06,22.86 95.25,22.86 93.98,22.23 | 93.98,17.14 93.98,13.54 v96.75,11.43 | 22.23,4.45 23.5,3.17 82.55,3.17 82.55,5.08 | v106.68,54.61 76.83,54.61 74.3,57.15 59.69,57.15 55.24,52.7 52.7,52.7 48.26,48.26 | 52.07,80.64 50.8,80.64 44.45,87 44.45,88.27 C206.P$2
  Bottom 1.27: v120.65,88.9 v120.65,92.71 120.65,93.34 121.28,93.98 SL502.1 | L201.1 79.38,76.2 79.38,77.47 76.2,80.64 72.39,80.64 | 139.06,105.41 v139.06,104.78 | 139.06,105.41 122.56,105.41 121.6,104.46 | 13.97,29.84 15.88,29.84 | 15.88,29.84 C205.- | 102.87,22.86 103.07,22.66 | 82.55,8.89 82.55,11.43 79.38,11.43 79.38,12.06 79.38,27.94 | v121.28,45.28 124.78,45.28 | 48.26,48.26 46.99,46.99 IC701.8 46.99,45.72 48.9,43.81 52.7,43.81 54.61,45.72 | 48.26,48.26 SL201.2 | 54.61,45.72 56.52,43.81 57.78,43.81 59.69,45.72 IC701.3 | 54.61,45.72 IC701.5
  Bottom 1.524: 13.34,29.84 13.97,29.84
  Bottom 1.778: IC202.GND 13.34,29.84
  Bottom 2.032: 13.34,3.81 C207.- 4.45,3.81 C208.P$2 | 13.34,3.81 C210.- 22.23,3.81 22.23,4.45 C209.P$2 | 13.34,3.81 IC202.GND | AVR-LPC.31 110.49,60.96 113.03,58.42 113.03,54.61 AVR-LPC.11 SL301.6 C301.P$2 C304.P$2 114.3,40.01 116.84,37.47 123.83,37.47 125.09,38.73 C302.P$2 125.09,45.09 | 153.67,95.25 IC201.GND | 153.67,95.25 C201.- | C204.- 153.67,95.25 | 125.09,45.09 C303.P$2 | R505.P$1 R504.P$1 127.64,45.09 | 127.64,45.09 R502.P$1 | 125.09,45.09 127.64,45.09 | 115.57,24.13 v115.57,26.67 | 24.77,36.83 arc33 23.5,38.1 arc29 20.95,38.73 arc-1 17.78,38.73 arc1 8.89,38.73 4.45,38.73 4.45,34.92 v4.44,26.02 | DB201.- C206.P$2 41.27,92.08 44.45,95.25 X101.3 | v120.65,83.82 SL502.5 | v120.65,88.9 SL502.3 | I605.3
  Bottom 2.184: 4.45,34.92 v4.45,32.38
  other vias: 121.77,11.43
  pour Bottom (isolate 0.838, no thermals): 0.64,0 0.64,98.42 8.26,90.17 8.26,68.58 11.43,65.41 14.61,65.41 17.14,67.94 17.14,71.75 16.51,72.39 16.51,93.34 14.61,95.89 26.04,95.89 19.05,89.53 19.05,71.12 24.77,65.41 36.2,65.41 38.1,67.94 38.1,71.12 35.56,73.66 29.84,73.66 27.94,74.93 27.94,87 30.48,89.53 33.02,89.53 38.1,95.25 40.01,95.25 43.18,98.42 43.18,106.68 46.35,106.68 46.35,85.72 50.8,80.64 78.11,80.64 78.11,80.01 80.64,77.47 80.64,73.03 81.92,71.75 82.55,71.75 82.55,70.48 92.08,70.48 92.08,87 114.3,87 114.3,99.06 111.76,99.06 111.76,106.68 160.02,106.68 160.02,0
GNDI
  Bottom 1.27: 57.15,83.19 52.07,83.19 I601.2 | 57.15,83.19 I602.2 | 57.15,83.19 62.23,83.19 | 62.23,83.19 I603.2 | 62.23,83.19 67.31,83.19 | 67.31,83.19 72.39,83.19 I605.2 | 67.31,83.19 I604.2
  Bottom 2.032: I605.2 D610.A | I602.2 D604.A | I604.2 D608.A | I603.2 D607.A | I601.2 D603.A
  pour Bottom (isolate 0.635, no thermals): 48.26,86.36 48.26,106.05 76.83,106.68 76.83,83.19 72.39,83.19 51.44,83.19
I0
  Bottom 2.032: R603.P$1 X101.1
I1
  Bottom 2.032: R604.P$1 X102.7
I2
  Bottom 2.032: R607.P$1 X102.6
I3
  Bottom 2.032: R608.P$1 X102.5
I4
  Bottom 2.032: R610.P$1 X102.4
IN_PUT0
  Bottom 1.27: AVR-LPC.36 97.79,66.67 90.17,59.05 78.74,59.05 75.56,62.23 62.23,62.23 54.61,69.85 54.61,70.26 R601.P$1 I601.4 | I601.4
IN_PUT1
  Bottom 1.27: AVR-LPC.37 95.25,66.67 89.53,60.96 79.38,60.96 76.2,64.14 65.41,64.14 59.69,69.85 59.69,70.28 R602.P$1 I602.4 | I602.4
IN_PUT2
  Bottom 1.27: AVR-LPC.38 92.71,66.67 88.9,62.87 80.01,62.87 76.83,66.04 68.58,66.04 64.77,69.85 64.77,70.28 R605.P$1 I603.4 | I603.4
IN_PUT3
  Bottom 1.27: AVR-LPC.39 90.17,66.67 88.27,64.77 80.64,64.77 77.47,67.94 71.75,67.94 69.85,69.85 69.85,70.26 R606.P$1 I604.4 | I604.4
IN_PUT4
  Bottom 1.27: R609.P$1 74.93,69.85 78.11,69.85 81.28,66.67 87,66.67 AVR-LPC.40 | R609.P$1 | I605.4 | R609.P$1 I605.4
ISP_RESET
  Bottom 1.27: C301.P$1 107.31,43.18 R301.P$1
  Bottom 2.032: AVR-LPC.9 SL301.4 C301.P$1
KB_INT
  Bottom 1.27: AVR-LPC.16 125.73,52.7 127.64,54.61 136.53,54.61 139.06,52.07 R501.P$2 142.24,52.07 146.05,48.26 D507.C
  Bottom 2.032: D504.C D505.C D506.C D507.C
L
  Bottom 3.2: F201.1 X101.6
N
  Bottom 2.54: TR201.1 25.6,69.65 22.86,72.39 22.86,87.63 29.21,93.98 30.48,93.98 34.29,97.79 X101.5
  Bottom 3.175: X101.5 X101.4
N$1
  Bottom 2.54: 5.71,99.69 12.7,92.08 12.7,70.48 | TR201.5 12.85,70.48
  Bottom 3.2: 5.71,99.69 F201.2 | 12.85,70.48 12.7,70.48
N$3
  Bottom 1.016: VR201.R 142.88,87.63 141.45,89 141.45,91.29 142.88,92.71 RP201.2
N$5
  Bottom 1.016: RP202.2 133.99,92.71 132.56,91.29 132.56,87.4 VR202.R
N$6
  Bottom 2.032: TR201.9 26.67,45.09 22.23,45.09 22.23,46.35 19.68,48.9 | 19.68,48.9 15.88,48.9 12.7,45.72 TR201.6 | DB201.AC1 27.94,85.72 27.94,74.93 34.29,74.93 38.1,71.12 38.1,67.94 34.29,64.14 20.32,64.14 20.32,50.16 19.68,48.9
N$7
  Bottom 1.27: R805.1 R806.2
N$10
  Bottom 1.27: AVR-LPC.12 115.57,45.38 Q301.1 C302.P$1
N$11
  Bottom 1.27: AVR-LPC.13 Q301.2 C303.P$1
  Bottom 2.032: AVR-LPC.13
N$15
  Bottom 1.27: RP201.1 142.56,95.25 R203.1
N$16
  Bottom 1.27: R802.P$2 104.14,93.98 107.95,93.98 109.86,95.89 IC802.2
  Bottom 2.032: IC802.2 IC802.1
N$20
  Bottom 2.032: D201.A R205.P$1
N$21
  Bottom 1.27: R803.2 82.55,93.98 85.09,91.44 85.09,86.36 83.19,84.45 IC801.3
N$22
  Bottom 2.032: D601.C R603.P$2
N$23
  Bottom 2.032: I601.1 D603.C D601.A
N$24
  Bottom 1.27: D501.C 97.16,34.29 100.33,31.11 SL501.8
N$25
  Bottom 1.27: D502.C 99.69,34.92 101.6,33.02 137.16,33.02 137.79,33.66 SL501.7
N$26
  Bottom 2.032: D605.C R607.P$2
N$27
  Bottom 2.032: I603.1 D607.C D605.A
N$28
  Bottom 1.27: D503.C 103.5,34.92 136.53,34.92 137.79,36.2 SL501.6
N$29
  Bottom 1.27: SL201.1 48.26,57.15
  Bottom 2.184: 48.26,57.15 R207.P$1
N$34
  Bottom 2.032: D202.A R206.P$1
N$37
  Bottom 2.032: TR201.7 20.95,41.91 24.77,41.91 26.04,40.64 29.84,40.64 33.02,43.81 32.38,43.81 TR201.10 33.02,52.7 33.02,61.34 35.56,61.34 40.89,66.8 40.89,72.39 35.56,77.72 31.11,77.72 DB201.AC2
N$38
  Bottom 1.27: R809.2 R808.1
N$39
  Bottom 2.032: D609.C R610.P$2
N$40
  Bottom 2.032: I605.1 D610.C D609.A
N$41
  Bottom 2.032: R801.P$1 IC801.5
  Bottom 2.54: C801.P$1 R807.P$2 R801.P$1
N$42
  Bottom 1.27: R801.P$2 80.01,81.28 80.01,85.09 81.92,87 IC801.2
  Bottom 2.032: IC801.2 IC801.1
N$43
  Bottom 2.032: D602.C R604.P$2
N$44
  Bottom 2.032: I602.1 D604.C D602.A
N$45
  Bottom 2.032: R802.P$1 IC802.5
  Bottom 2.54: R802.P$1 R810.P$2 C802.P$1
N$46
  Bottom 0.813: TVS401.1 TVS402.2 145.2,8.04 145.41,8.26 IC401.7 145.41,10.79 142.24,13.97 142.24,15.24 139.85,17.63 R401.1
N$47
  Bottom 1.27: RP202.1 133.66,95.25 R204.1
N$48
  Bottom 1.27: R804.2 IC802.3
N$51
  Bottom 2.032: D606.C R608.P$2
N$52
  Bottom 2.032: I604.1 D608.C D606.A
N$93
  Bottom 0.813: IC401.6 146.69,8.26 146.9,8.04 TVS402.1 | TVS402.1 TVS403.2 | TVS402.1 146.9,5.93 146.05,5.08 141.6,5.08 140.97,5.71 140.34,6.35 140.34,8.89 138.43,10.79 R405.1
N$112
  Bottom 1.27: SW401.7 R403.1
N$129
  Bottom 1.27: SW401.6 R404.2
N$140
  Bottom 1.27: SW401.8 R402.1
OUT_PUT0
  Bottom 1.27: AVR-LPC.1 87.63,52.7 74.93,52.7 73.03,54.61 61.59,54.61 59.69,52.7 57.78,52.7 55.88,50.8 53.34,50.8 49.53,46.99 IC701.7
OUT_PUT1
  Bottom 1.27: AVR-LPC.2 90.17,50.8 88.9,49.53 86.36,49.53 85.09,50.8 74.3,50.8 72.39,52.7 62.23,52.7 60.33,50.8 58.42,50.8 56.52,48.9 53.98,48.9 52.07,46.99 IC701.6
OUT_PUT2
  Bottom 1.27: AVR-LPC.3 92.71,50.8 89.53,47.62 85.72,47.62 84.45,48.9 73.66,48.9 71.75,50.8 62.87,50.8 60.96,48.9 59.05,48.9 57.15,46.99 IC701.4
OUT_PUT3
  Bottom 1.27: AVR-LPC.4 95.25,50.8 90.17,45.72 85.09,45.72 83.82,46.99 73.03,46.99 71.12,48.9 63.5,48.9 62.23,47.62 IC701.2
OUT_PUT4
  Bottom 1.27: AVR-LPC.5 97.79,50.8 90.81,43.81 84.45,43.81 83.19,45.09 72.39,45.09 70.48,46.99 65.41,46.99 IC701.1
Q0
  Bottom 1.27: K701.P1 31.11,26.04 29.84,26.04 28.57,24.77 28.57,7.62 X103.1
Q1
  Bottom 1.27: K701.S1 31.43,9.53 33.27,9.53 33.27,7.71 33.56,7.71 X103.2
Q2
  Bottom 1.27: K702.P1 41.91,25.86 41.91,23.34 35.56,23.34 35.56,11.43 39.37,11.43 | 39.37,11.43 39.57,11.43 | X103.3 39.37,11.43
Q3
  Bottom 1.27: K702.S1 42.55,15.7 42.55,15.88 44.45,15.88 X103.4
Q4
  Bottom 1.27: K703.P1 53.34,25.86 53.34,23.34 46.99,23.34 46.99,12.7 49.61,12.7 49.53,12.62 X103.5
Q5
  Bottom 1.27: K703.S1 53.98,16.34 54.61,15.88 54.61,10.79 | X103.6 54.61,10.79 | 54.61,10.79
Q6
  Bottom 1.27: K704.P1 63.82,23.34 57.15,23.34 57.15,12.7 59.69,12.7 X104.1
Q7
  Bottom 1.27: K704.S1 64.31,15.7 64.77,15.88 X104.2
Q8
  Bottom 1.27: K705.P1 74.3,25.54 74.3,23.5 67.94,23.5 67.94,12.7 69.85,12.7 X104.3
Q9
  Bottom 1.27: X104.4 74.93,15.38 K705.S1
RELAY0
  Bottom 1.27: K701.16 39.05,35.24 40.01,36.2 47.62,36.2 49.53,38.1 IC701.10
RELAY1
  Bottom 1.27: K702.16 50.16,33.8 50.16,36.2 52.07,38.1 IC701.11
RELAY2
  Bottom 1.27: K703.16 57.33,33.48 57.15,33.66 IC701.13
RELAY3
  Bottom 1.27: K704.16 70.48,33.66 66.67,33.66 66.67,36.2 64.14,36.2 62.23,38.1 IC701.15
RELAY4
  Bottom 1.27: K705.16 81.92,33.66 77.47,33.66 77.47,36.2 68.58,36.2 68.58,38.1 64.77,38.1 IC701.16
ROW0
  Bottom 1.27: R505.P$2 130.18,38.73 130.18,49.53 128.27,51.44 AVR-LPC.17
  Bottom 2.032: D504.A SL501.5 R505.P$2
ROW1
  Bottom 1.27: R504.P$2 132.08,41.27 132.08,50.16 130.81,51.44 AVR-LPC.18
  Bottom 2.032: D505.A SL501.4 R504.P$2
ROW2
  Bottom 1.27: R503.P$2 133.99,43.81 133.99,50.8 133.35,51.44 AVR-LPC.19
  Bottom 2.032: R503.P$2 SL501.3 D506.A
ROW3
  Bottom 1.27: R502.P$2 135.89,46.35 AVR-LPC.20
  Bottom 2.032: D507.A SL501.2 R502.P$2
RS  (via drill 0.61 pad 6.35)
  Bottom 1.27: AVR-LPC.33 105.41,67.94 106.05,68.58 106.05,74.93 112.39,81.28 | 112.39,81.28 118.11,81.28 118.11,84.45 120.02,86.36 SL502.4 | v110.24,83.08 110.59,83.08 112.39,81.28
RXD
  Bottom 0.813: IC401.1 144.15,16.51 143.51,17.14 142.24,17.14 140.34,19.05 140.34,20.32 141.6,21.59 142.24,22.23 143.51,22.23
  Bottom 1.27: AVR-LPC.15 123.19,52.7 127,56.52 137.16,56.52 139.06,54.61 142.24,54.61 148.59,48.26 148.59,36.2 143.51,36.2 143.51,22.23
TXD
  Bottom 0.813: IC401.4 147.96,17.14 147.32,17.78 146.69,17.78 145.41,19.05 145.41,20.95
  Bottom 1.27: AVR-LPC.14 120.65,52.7 126.36,58.42 137.79,58.42 139.7,56.52 142.88,56.52 150.5,48.9 150.5,34.29 145.41,34.29 145.41,20.95
TXE/!RXE  (via drill 0.6 pad 2.18)
  Top 0.813: v142.88,19.68 v147.32,19.68
  Bottom 0.813: IC401.3 IC401.2 | IC401.3 146.15,15.77 | IC401.3 146.05,15.77 146.05,16.51 v142.88,19.68
  Bottom 1.27: AVR-LPC.22 133.35,66.04 134.62,64.77 141.6,64.77 143.51,62.87 143.51,60.96 149.22,55.24 150.5,55.24 152.4,53.34 152.4,32.38 147.32,32.38 v147.32,19.68
(copper drawn outside any net)
  shapes: Route15 area x4, Route15 circle x2

### Text on the board
Top: AVR-LPC v.0.0.4 | 30.04.2011
Bottom: AVR-LPC v.0.0.3 | 01.11.2010
tNames: 1 | RP201 | RP202 | 1
tValues: 2K* | 2K* | TP_GND
Document: AREF | AVCC | +5V | SCL | SDA